# Altium project LoaPhuong_Main.PrjPcb
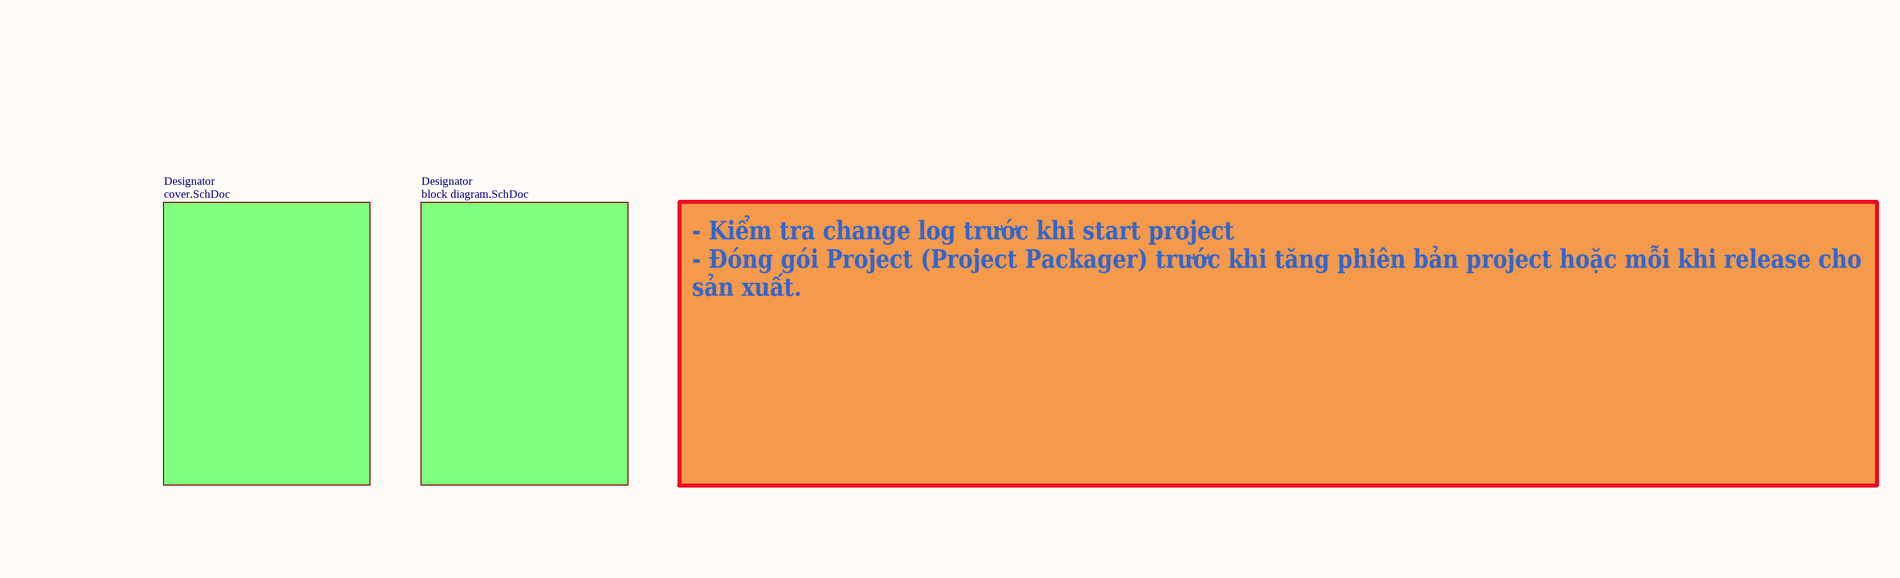
[diagram p0: root.SchDoc, left]
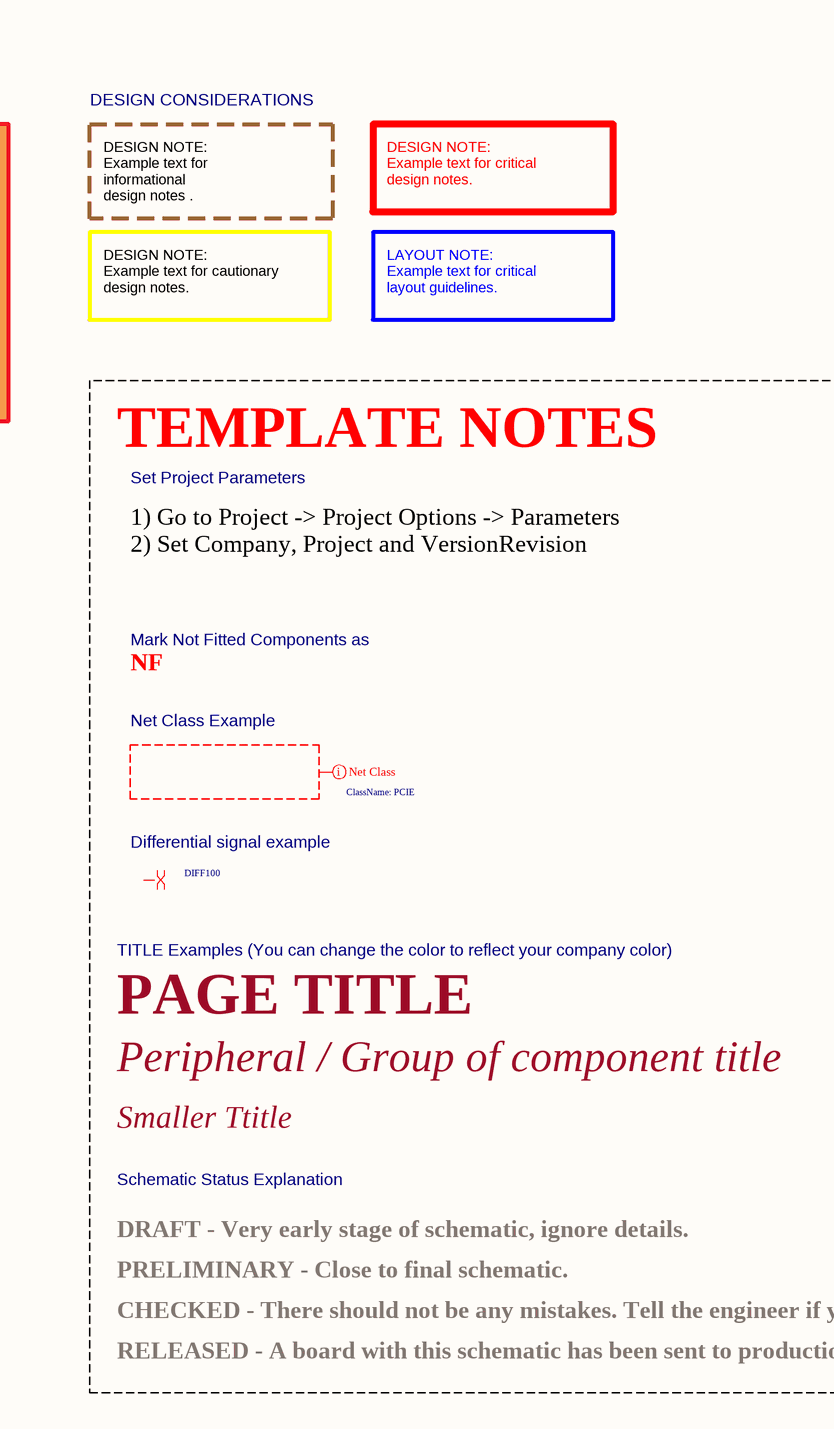
[diagram p1: root.SchDoc, right]
VersionRevision: v1.0A
7 sheets, 214 parts. Net scope: hierarchical (ports join the sheet entries above them; power ports are global).
Board file: Final_Project.PcbDoc
Sheets:
  root.SchDoc
    Designator = cover.SchDoc
    Designator = block diagram.SchDoc
      U_4G = 4G.SchDoc
      U_Wifi = Wifi.SchDoc
      U_Audio = Audio.SchDoc
      U_Power = Power.SchDoc

## Sheet root.SchDoc: PROJECT DIAGRAM
size A2; ApprovedBy: ---; CheckedBy: ---; CompanyName: BINHANH ELECTRONICS; DrawnBy: BienNB; DocumentNumber: 1; Revision: V1.0; SheetNumber: 1; SheetTotal: 11; PageSetup: Record=PageOptions|CenterHorizontal=True|CenterVertical=True|PrintScale=1.07|XCorrection=1.00|YCorrection=1.00|PrintKind=1|BorderSize=5000000|LeftOffset=0|BottomOffset=0|Orientation=2|PaperLength=1000|PaperWidth=1000|Scale=100|PaperSource=7|PrintQuality=600|MediaType=1|DitherType=10|PaperKind=A3|PrintScaleMode=1; Stage: DRAFT

### Sub-sheets
Designator = cover.SchDoc: no entries
Designator = block diagram.SchDoc: no entries

### Layout directives
net class PCIE: (no net found under the mark)
differential pair; net class DIFF100: (no net found under the mark)

### Notes on the sheet
- DESIGN CONSIDERATIONS
- DESIGN NOTE:
  Example text for informational
  design notes .
- DESIGN NOTE:
  Example text for critical
  design notes.
- DESIGN NOTE:
  Example text for cautionary
  design notes.
- LAYOUT NOTE:
  Example text for critical
  layout guidelines.
- - Kiểm tra change log trước khi start project
  - Đóng gói Project (Project Packager) trước khi tăng phiên bản project hoặc mỗi khi release cho sản xuất.
- TEMPLATE NOTES
- Set Project Parameters
- 1) Go to Project -> Project Options -> Parameters
  2) Set Company, Project and VersionRevision
- NF
- Mark Not Fitted Components as
- Net Class Example
- Differential signal example
- TITLE Examples (You can change the color to reflect your company color)
- PAGE TITLE
- Peripheral / Group of component title
- Smaller Ttitle
- Schematic Status Explanation
- PRELIMINARY - Close to final schematic.
- DRAFT - Very early stage of schematic, ignore details.
- RELEASED - A board with this schematic has been sent to production.
- CHECKED - There should not be any mistakes. Tell the engineer if you find one.
- Project:
- File:
- Size
- Rev
- A2
- Sheet
- /
- Drawn by:
- Checked by:
- Approved by:

## Sheet cover.SchDoc
size A3; DocumentNumber: 2; Revision: V1.0; SheetNumber: 2; SheetTotal: 11; Stage: DRAFT
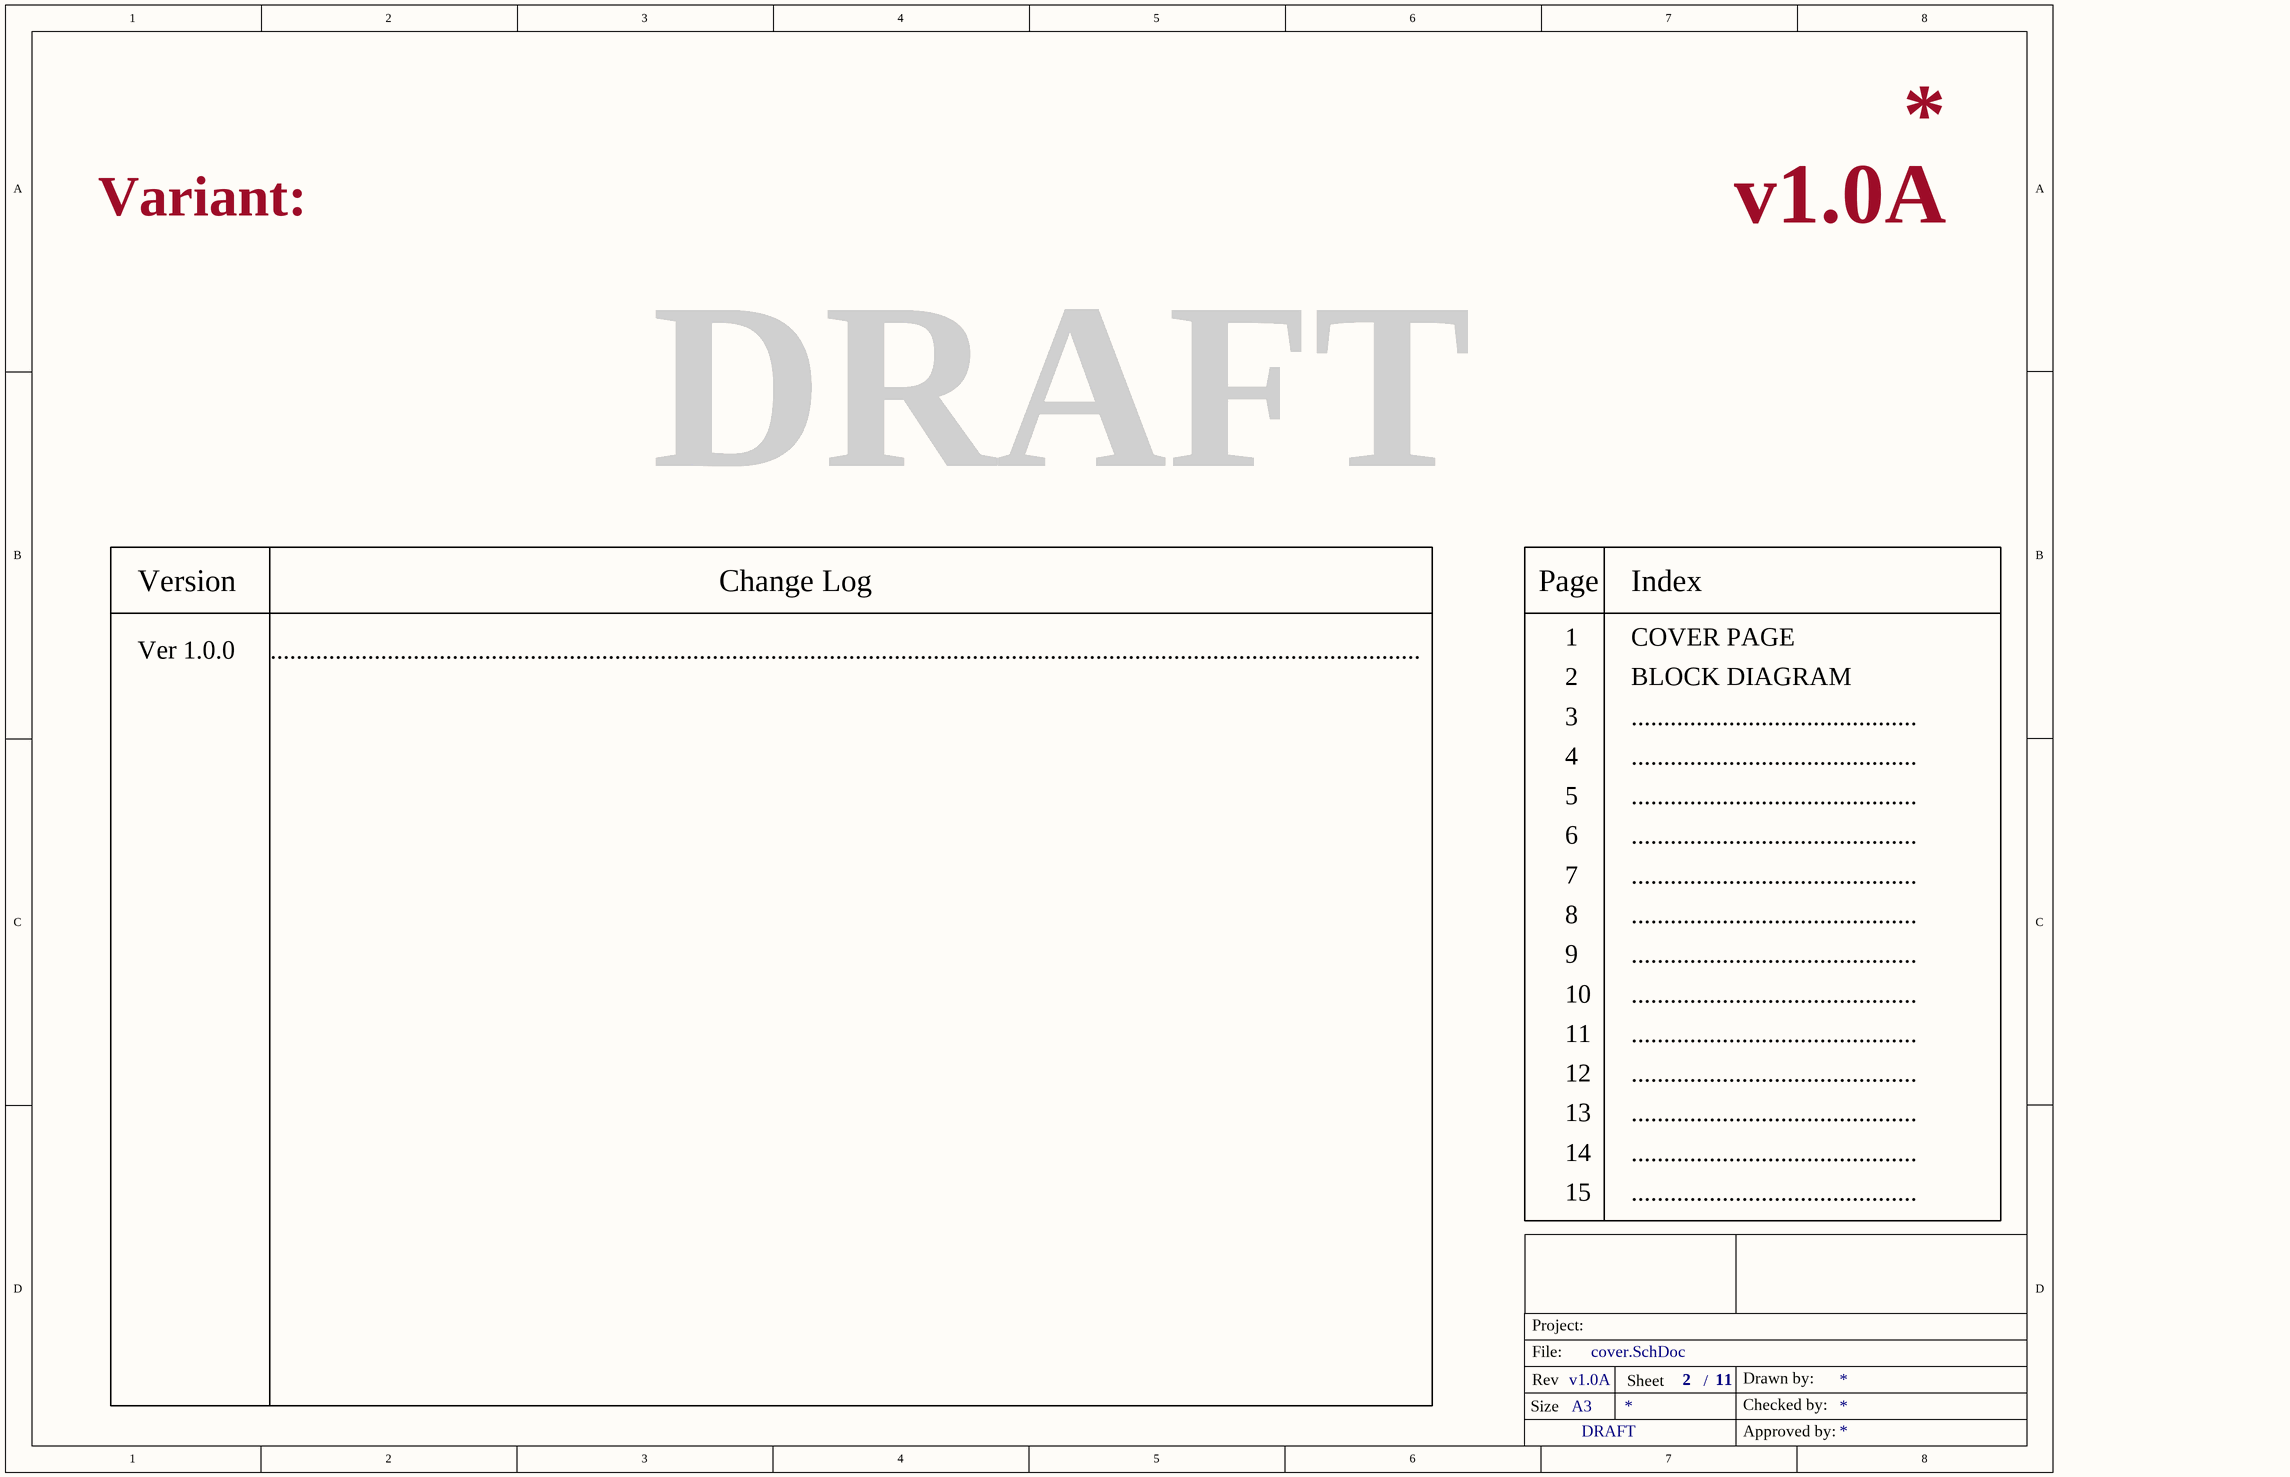
[diagram p2: cover.SchDoc]

### Notes on the sheet
- Variant:
- Version
- Change Log
- Page
- Index
- Ver 1.0.0
- .................................................................................................................................................................................
- 1
- 2
- COVER PAGE
- BLOCK DIAGRAM
- 3
- 4
- ............................................
- 5
- 6
- 7
- 8
- 9
- 10
- 11
- 12
- 13
- 14
- 15
- Project:
- File:
- Size
- Rev
- A3
- Sheet
- /
- Drawn by:
- Checked by:
- Approved by:

## Sheet block diagram.SchDoc
size A3; DocumentNumber: 3; Revision: V1.0; SheetNumber: 3; SheetTotal: 11; Stage: DRAFT
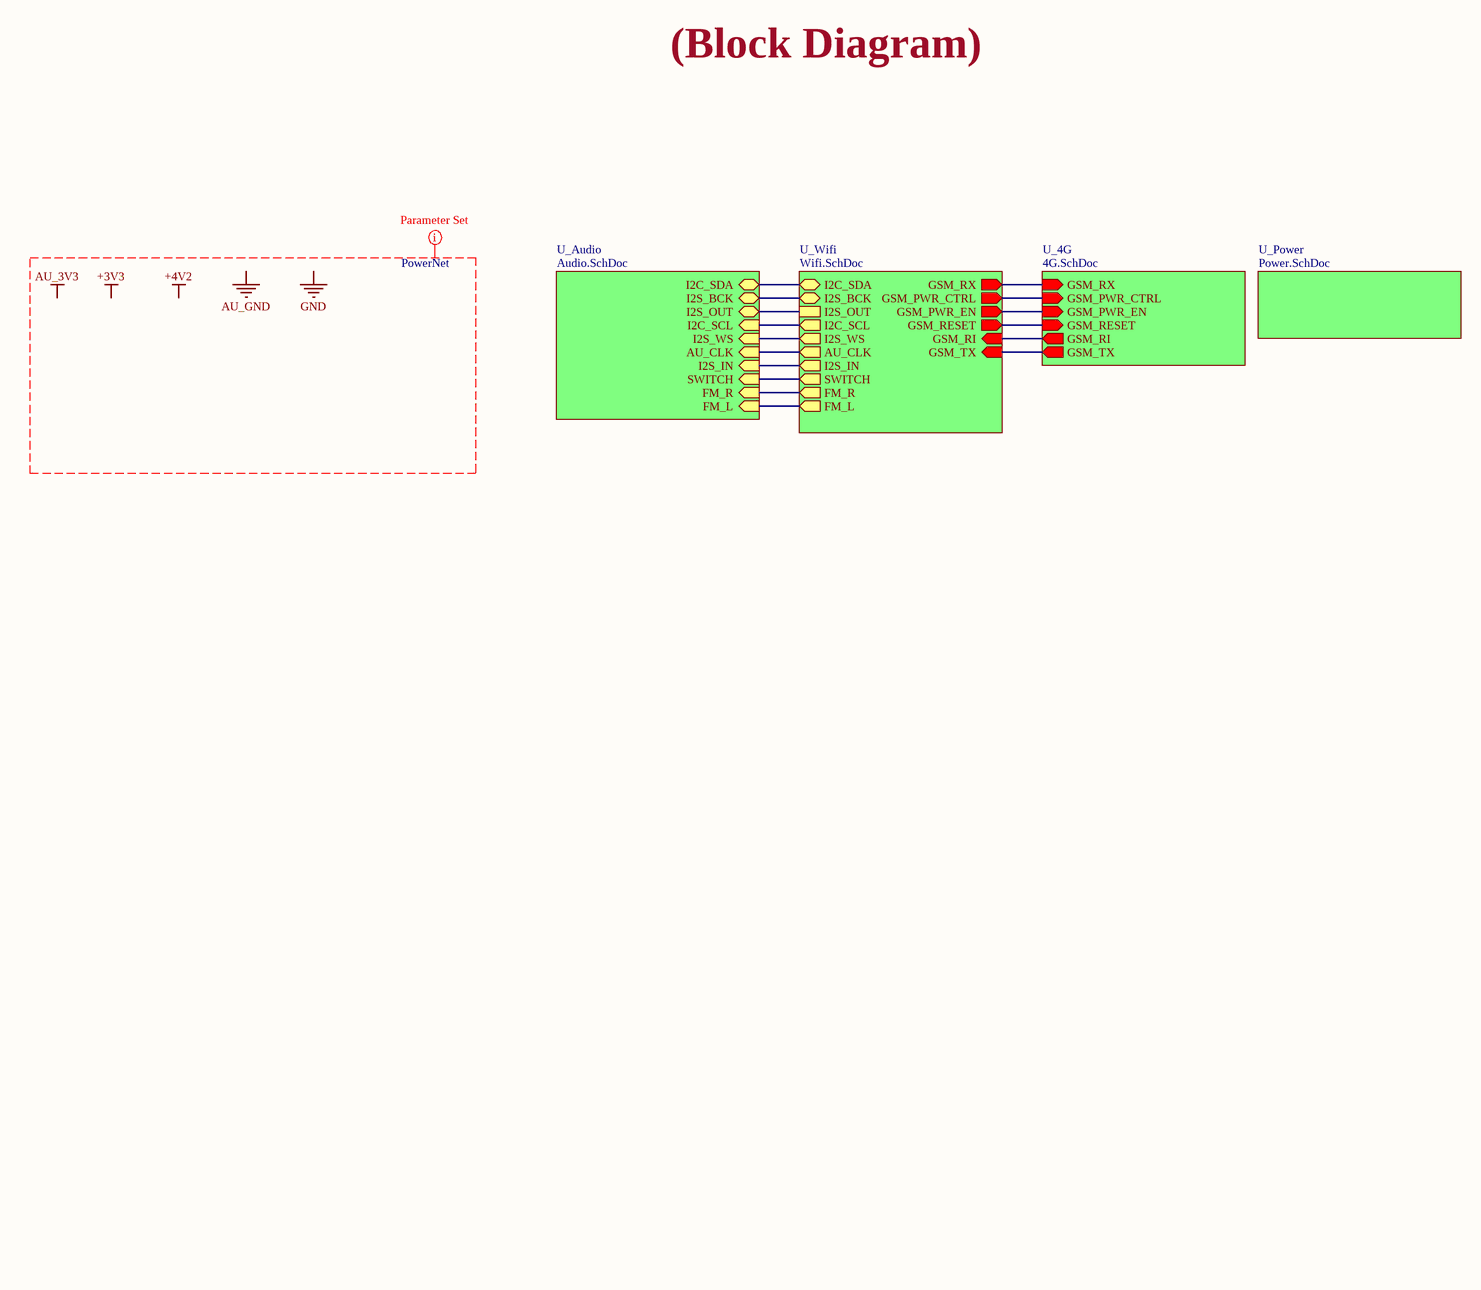
[diagram p3: block diagram.SchDoc]

### Sub-sheets
U_4G = 4G.SchDoc: GSM_PWR_EN (in), GSM_RESET (in), GSM_PWR_CTRL (in), GSM_RX (in), GSM_TX (out), GSM_RI (out)
U_Audio = Audio.SchDoc: I2C_SCL (in), I2C_SDA (bidir), I2S_BCK (bidir), I2S_WS (in), I2S_IN (in), I2S_OUT (bidir), AU_CLK (in), SWITCH (in), FM_L (in), FM_R (in)
U_Power = Power.SchDoc: no entries
U_Wifi = Wifi.SchDoc: I2C_SCL (out), I2C_SDA (bidir), I2S_BCK (bidir), I2S_OUT, I2S_WS (out), I2S_IN (out), GSM_RX (out), GSM_TX (in), GSM_RI (in), AU_CLK (out), FM_L (out), FM_R (out), GSM_PWR_CTRL (out), GSM_PWR_EN (out), GSM_RESET (out), SWITCH (out)

### Nets
ESP_RX: sheet U_Wifi/AU_CLK, sheet U_Audio/AU_CLK
FM_L: sheet U_Wifi/FM_L, sheet U_Audio/FM_L
FM_R: sheet U_Wifi/FM_R, sheet U_Audio/FM_R
GSM_PWKEY: sheet U_4G/GSM_PWR_EN, sheet U_Wifi/GSM_PWR_EN
GSM_PWR_EN: sheet U_4G/GSM_PWR_CTRL, sheet U_Wifi/GSM_PWR_CTRL
GSM_RESET: sheet U_4G/GSM_RESET, sheet U_Wifi/GSM_RESET
SCL: sheet U_Wifi/I2C_SCL, sheet U_Audio/I2C_SCL
SDA: sheet U_Wifi/I2C_SDA, sheet U_Audio/I2C_SDA
SWITCH_FM: sheet U_Wifi/SWITCH, sheet U_Audio/SWITCH
NetM1_62: sheet U_4G/GSM_RI, sheet U_Wifi/GSM_RI
NetM1_67: sheet U_4G/GSM_TX, sheet U_Wifi/GSM_TX
NetM1_68: sheet U_4G/GSM_RX, sheet U_Wifi/GSM_RX
NetR23_1: sheet U_Wifi/I2S_BCK, sheet U_Audio/I2S_BCK
NetR24_1: sheet U_Wifi/I2S_WS, sheet U_Audio/I2S_WS
NetR25_1: sheet U_Wifi/I2S_IN, sheet U_Audio/I2S_IN
NetR26_1: sheet U_Wifi/I2S_OUT, sheet U_Audio/I2S_OUT

### Layout directives
net class PowerNet: +3V3, +4V2, AU_3V3, AU_GND, GND

### Notes on the sheet
- (Block Diagram)
- CLOCKS (CPU & PCIE)
- Labels drawn without touching a wire or pin: +3V3, +4V2, AU_3V3, AU_GND, GND
- Project:
- File:
- Size
- Rev
- A3
- Sheet
- /
- Drawn by:
- Checked by:
- Approved by:

## Sheet 4G.SchDoc: 4G
size A3; Organization: Altium Limited; Address1: L3, 12a Rodborough Rd; Address2: Frenchs Forest; Address3: NSW; Address4: Australia 2086; Stage: DRAFT
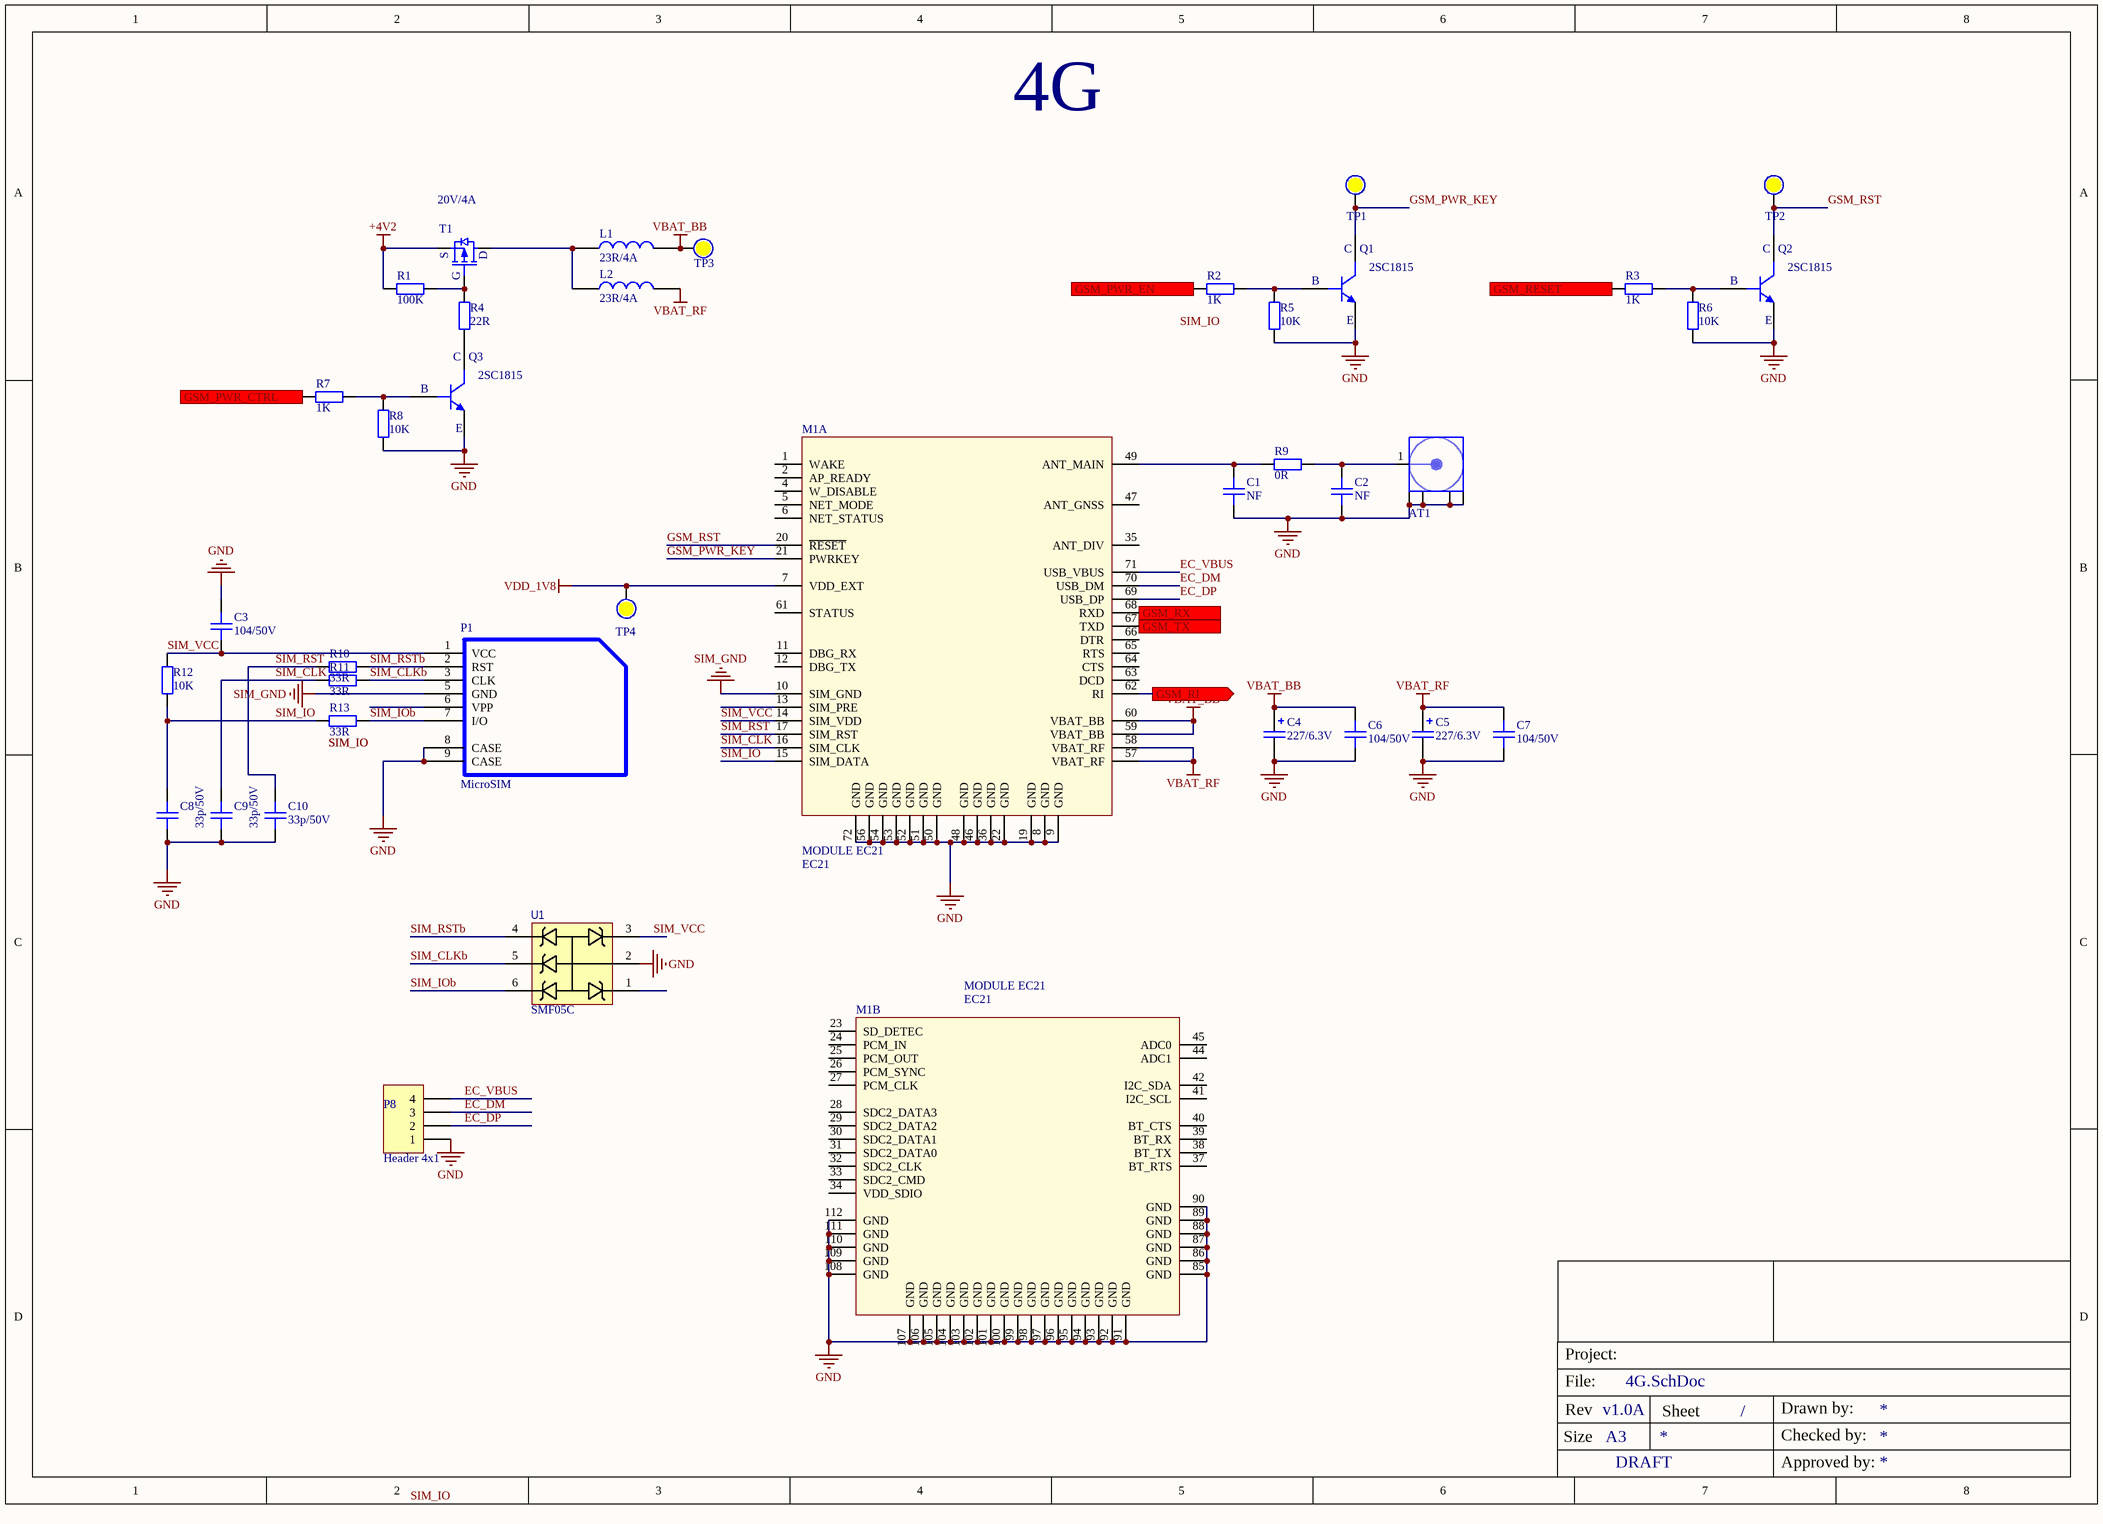
[diagram p4: 4G.SchDoc]

### Parts
AT1  AT-GSM-GPS  [SNW_H11-L17-SMA]  (value not drawn)
C1  NF  [CAPC-0603 (1608)]
C2  NF  [CAPC-0603 (1608)]
C3  104/50V  [CAPC-0603 (1608)]
C4  227/6.3V  [CAP_TANTAL_1210(3528)]
C5  227/6.3V  [CAP_TANTAL_1210(3528)]
C6  104/50V  [CAPC-0603 (1608)]
C7  104/50V  [CAPC-0603 (1608)]
C8  33p/50V  [CAPC-0603 (1608)]
C9  33p/50V  [CAPC-0603 (1608)]
C10  33p/50V  [CAPC-0603 (1608)]
L1  23R/4A  [IND-0603 (1608)]
L2  23R/4A  [IND-0603 (1608)]
M1  MODULE EC21  Part Number: EC21  [QUECTEL_EC20]  (parts A,B of 3)
P1  MicroSIM  [MUP-C792]
P8  Header 4x1  [HDR1X4]
Q1  2SC1815  [SOT23_3]
Q2  2SC1815  [SOT23_3]
Q3  2SC1815  [SOT23_3]
R1  100K  [RESC-0603 (1608)]
R2  1K  [RESC-0603 (1608)]
R3  1K  [RESC-0603 (1608)]
R4  22R  [RESC-0603 (1608)]
R5  10K  [RESC-0603 (1608)]
R6  10K  [RESC-0603 (1608)]
R7  1K  [RESC-0603 (1608)]
R8  10K  [RESC-0603 (1608)]
R9  0R  [RESC-0603 (1608)]
R10  33R  [RESC-0603 (1608)]
R11  33R  [RESC-0603 (1608)]
R12  10K  [RESC-0603 (1608)]
R13  33R  [RESC-0603 (1608)]
T1  20V/4A  [SOT23_3]
TP1  (no value)  [Test Point 1.5 MM]  (no BOM)
TP2  (no value)  [Test Point 1.5 MM]  (no BOM)
TP3  (no value)  [Test Point 1.5 MM]  (no BOM)
TP4  (no value)  [Test Point 1.5 MM]  (no BOM)
U1  SMF05C  [SOT65P210X140-6N]

### Ports
GSM_PWR_CTRL (in), GSM_PWR_EN (in), GSM_RESET (in), GSM_RI (out), GSM_RX (in), GSM_TX (out)

### Nets
+4V2: R1.1 T1.2(S)
GND: AT1.2 C1.1 C2.1 C3.2 C4.2 C5.2 C6.1 C7.1 C8.1 C9.1 C10.1 M1.8(GND) M1.9(GND) M1.19(GND) M1.22(GND) M1.36(GND) M1.46(GND) M1.48(GND) M1.50(GND) M1.51(GND) M1.52(GND) M1.53(GND) M1.54(GND) M1.56(GND) M1.72(GND) M1.85(GND) M1.86(GND) M1.87(GND) M1.88(GND) M1.89(GND) M1.90(GND) M1.91(GND) M1.92(GND) M1.93(GND) M1.94(GND) M1.95(GND) M1.96(GND) M1.97(GND) M1.98(GND) M1.99(GND) M1.100(GND) M1.101(GND) M1.102(GND) M1.103(GND) M1.104(GND) M1.105(GND) M1.106(GND) M1.107(GND) M1.108(GND) M1.109(GND) M1.110(GND) M1.111(GND) M1.112(GND) P1.8(CASE) P1.9(CASE) P8.1 Q1.2(E) Q2.2(E) Q3.2(E) R5.1 R6.1 R8.1 U1.2(AN)
SIM_GND: M1.10(SIM_GND) P1.5(GND)
VBAT_BB: C4.1 C6.2 L1.2 M1.59(VBAT_BB) M1.60(VBAT_BB) TP3.0
VBAT_RF: C5.1 C7.2 L2.2 M1.57(VBAT_RF) M1.58(VBAT_RF)
VDD_1V8: M1.7(VDD_EXT) TP4.0
EC_DM: M1.70(USB_DM) P8.3
EC_DP: M1.69(USB_DP) P8.2
EC_VBUS: M1.71(USB_VBUS) P8.4
GSM_PWKEY: R2.1 ; port GSM_PWR_EN
GSM_PWR_EN: R7.1 ; port GSM_PWR_CTRL
GSM_PWR_KEY: M1.21(PWRKEY) Q1.3(C) TP1.0
GSM_RESET: R3.1 ; port GSM_RESET
GSM_RST: M1.20(~{RESET}) Q2.3(C) TP2.0
SIM_CLK: C9.2 M1.16(SIM_CLK) R11.2
SIM_CLKb: P1.3(CLK) R11.1 U1.5(CT4)
SIM_IO: C8.2 M1.15(SIM_DATA) R12.1 R13.2
SIM_IOb: P1.7(I/O) R13.1 U1.6(CT5)
SIM_RST: C10.2 M1.17(SIM_RST) R10.2
SIM_RSTb: P1.2(RST) R10.1 U1.4(CT3)
SIM_VCC: C3.1 M1.14(SIM_VDD) P1.1(VCC) R12.2 U1.3(CT2)
NetAT1_1: AT1.1(Signal) C2.2 R9.2
NetC1_2: C1.2 M1.49(ANT_MAIN) R9.1
NetL1_1: L1.1 L2.1 T1.3(D)
NetM1_62: M1.62(RI) ; port GSM_RI
NetM1_67: M1.67(TXD) ; port GSM_TX
NetM1_68: M1.68(RXD) ; port GSM_RX
NetQ1_1: Q1.1(B) R2.2 R5.2
NetQ2_1: Q2.1(B) R3.2 R6.2
NetQ3_1: Q3.1(B) R7.2 R8.2
NetQ3_3: Q3.3(C) R4.1
NetR1_2: R1.2 R4.2 T1.1(G)

Not connected (* = marked no-connect by the designer): M1 1(WAKE) 2(AP_READY) 4(W_DISABLE) 5(NET_MODE) 6(NET_STATUS) 11(DBG_RX) 12(DBG_TX) 13(SIM_PRE) 23(SD_DETEC) 24(PCM_IN) 25(PCM_OUT) 26(PCM_SYNC) 27(PCM_CLK) 28(SDC2_DATA3) 29(SDC2_DATA2) 30(SDC2_DATA1) 31(SDC2_DATA0) 32(SDC2_CLK) 33(SDC2_CMD) 34(VDD_SDIO) 35(ANT_DIV) 37(BT_RTS) 38(BT_TX) 39(BT_RX) 40(BT_CTS) 41(I2C_SCL) 42(I2C_SDA) 44(ADC1) 45(ADC0) 47(ANT_GNSS) 61(STATUS) 63(DCD) 64(CTS) 65(RTS) 66(DTR); P1 6(VPP); U1 1(CT1)

### Notes on the sheet
- Labels drawn without touching a wire or pin: SIM_IO
- Project:
- File:
- Size
- Rev
- A3
- Sheet
- /
- Drawn by:
- Checked by:
- Approved by:

### Library data of the parts
AT1 = SNW_H11-L17-SMA: CONNECTER ANTENNA GPS GSM; MFR: Sunny Way; Solder: HAND; MPN: SNW_H11-L17-SMA; Value: AT-GSM-GPS; ClassName: MECHANICAL
C1 C2 = CAPC NF 0603: CAP SMD, Not Fill, 0603; Solder: Not Fill; Value: NF; Category: CAPACITOR
C3 C6 C7 = C0603C104K5RACTU: CAP CER 0.1uF 50V 10% X7R 0603; CompanyID: VT-00982; Solder: SMT; MPN: C0603C104K5RACTU; Value: 104/50V; Category: CAPACITOR
C4 C5 = T520B227M006ATE035: CAP TANT POLY 220uF 20% 6.3V 3528 35mOhm ESR; Solder: SMT; CompanyID: VT-00643; Value: 227/6.3V; MPN: T520B227M006ATE035; Category: CAPACITOR
C8-C10 = 0603N330J500CT: CAP CER 33pF 50V 5%  0603; MPN: CL10C330JB8NNNC; CompanyID: VT-01106; Solder: SMT; Value: 33p/50V; Category: CAPACITOR
L1 L2 = FBMJ1608HM230NT: IND-FERRITE BEAD 23 OHM  4A 0603 1LN; CompanyID: VT-01060; Solder: SMT; MPN: FBMJ1608HM230NT; Value: 23R/4A; Category: FERRITE BEAD
M1 = QUECTEL EC21: Quectel EC21 is a series of LTE category; Brand: Quectel
P1 = MUP-C792: MicroSIM Card Push - Push Holder; MFR: MUP; MPN: C792; Solder: SMT; ClassName: MECHANICAL
P8 = Header 4x1: Header, 4 Pin Pitch 2.54mm; MPN: S1012EC-40-ND; Solder: WAVE; Value: Header 4P; ClassName: MECHANICAL
Q1-Q3 = 2SC1815: TRANS NPN 50V 0.15A SOT23-3; Solder: SMT; MPN: 2SC1815; Value: 2SC1815
R1 = RC0603FR-07100KL: RES SMD 100K OHM 1% 1/10W 0603; CompanyID: VT-00332; Solder: SMT; MPN: RC0603FR-07100KL; Value: 100K; Category: RESISTOR
R2 R3 R7 = RC0603FR-071KL: RES SMD 1 KOHM 1% 1/10W 0603; CompanyID: VT-00574; Solder: SMT; MPN: RC0603FR-071KL; Value: 1K; Category: RESISTOR
R4 = RC0603FR-0722RL: RES SMD 22 OHM 1% 1/10W 0603; CompanyID: VT-00881; Solder: SMT; Value: 22R; MPN: RC0603FR-0722RL; Category: RESISTOR
R5 R6 R8 R12 = RC0603FR-0710KL: RES SMD 10K OHM 1% 1/10W 0603; CompanyID: VT-00328; Solder: SMT; MPN: RC0603FR-0710KL; Value: 10K; Category: RESISTOR
R9 = RC0603FR-070RL: RES SMD 0.0OHM JUMPER 1/10W 0603; CompanyID: VT-00901; Solder: SMT; MPN: RC0603FR-070RL; Value: 0R; Category: RESISTOR
R10 R11 R13 = RC0603FR-0733RL: RES SMD 33 OHM 1% 1/10W 0603; MFR: Yageo; Solder: SMT; MPN: RC0603FR-0733RL; Value: 33R; Category: RESISTOR
T1 = AO3415: MOSFET P-CH 20V 4A SOT23; MFR: Alpha & Omega Semiconductor Inc.; Solder: SMT; Value: 20V/4A; MPN: AO3415
TP1-TP4 = Test Point: Solder: NF
U1 = SMF05C: TVS Diode Array For ESD and Latch-Up Protection; MFR: ON SEMICONDUCTOR; Value: SMF05CT2G; Solder: SMT; CompanyID: VT-0; ComponentLink1URL: http://www.onsemi.com/pub/Collateral/SMF05C-D.PDF; ComponentLink1Description: http://www.onsemi.com/pub/Collateral/SMF05C-D.PDF; MPN: SMF05CT2G; Category: IC

## Sheet Wifi.SchDoc: Wifi_Main
size A3; Author: TueTD; DrawnBy: TueTD; DocumentNumber: 1; Revision: V1.0; SheetNumber: 1; Stage: DRAFT; ENG_APP_DATE: --/--/--; DSN_APP_DATE: --/--/--; CHK_APP_DATE: --/--/--
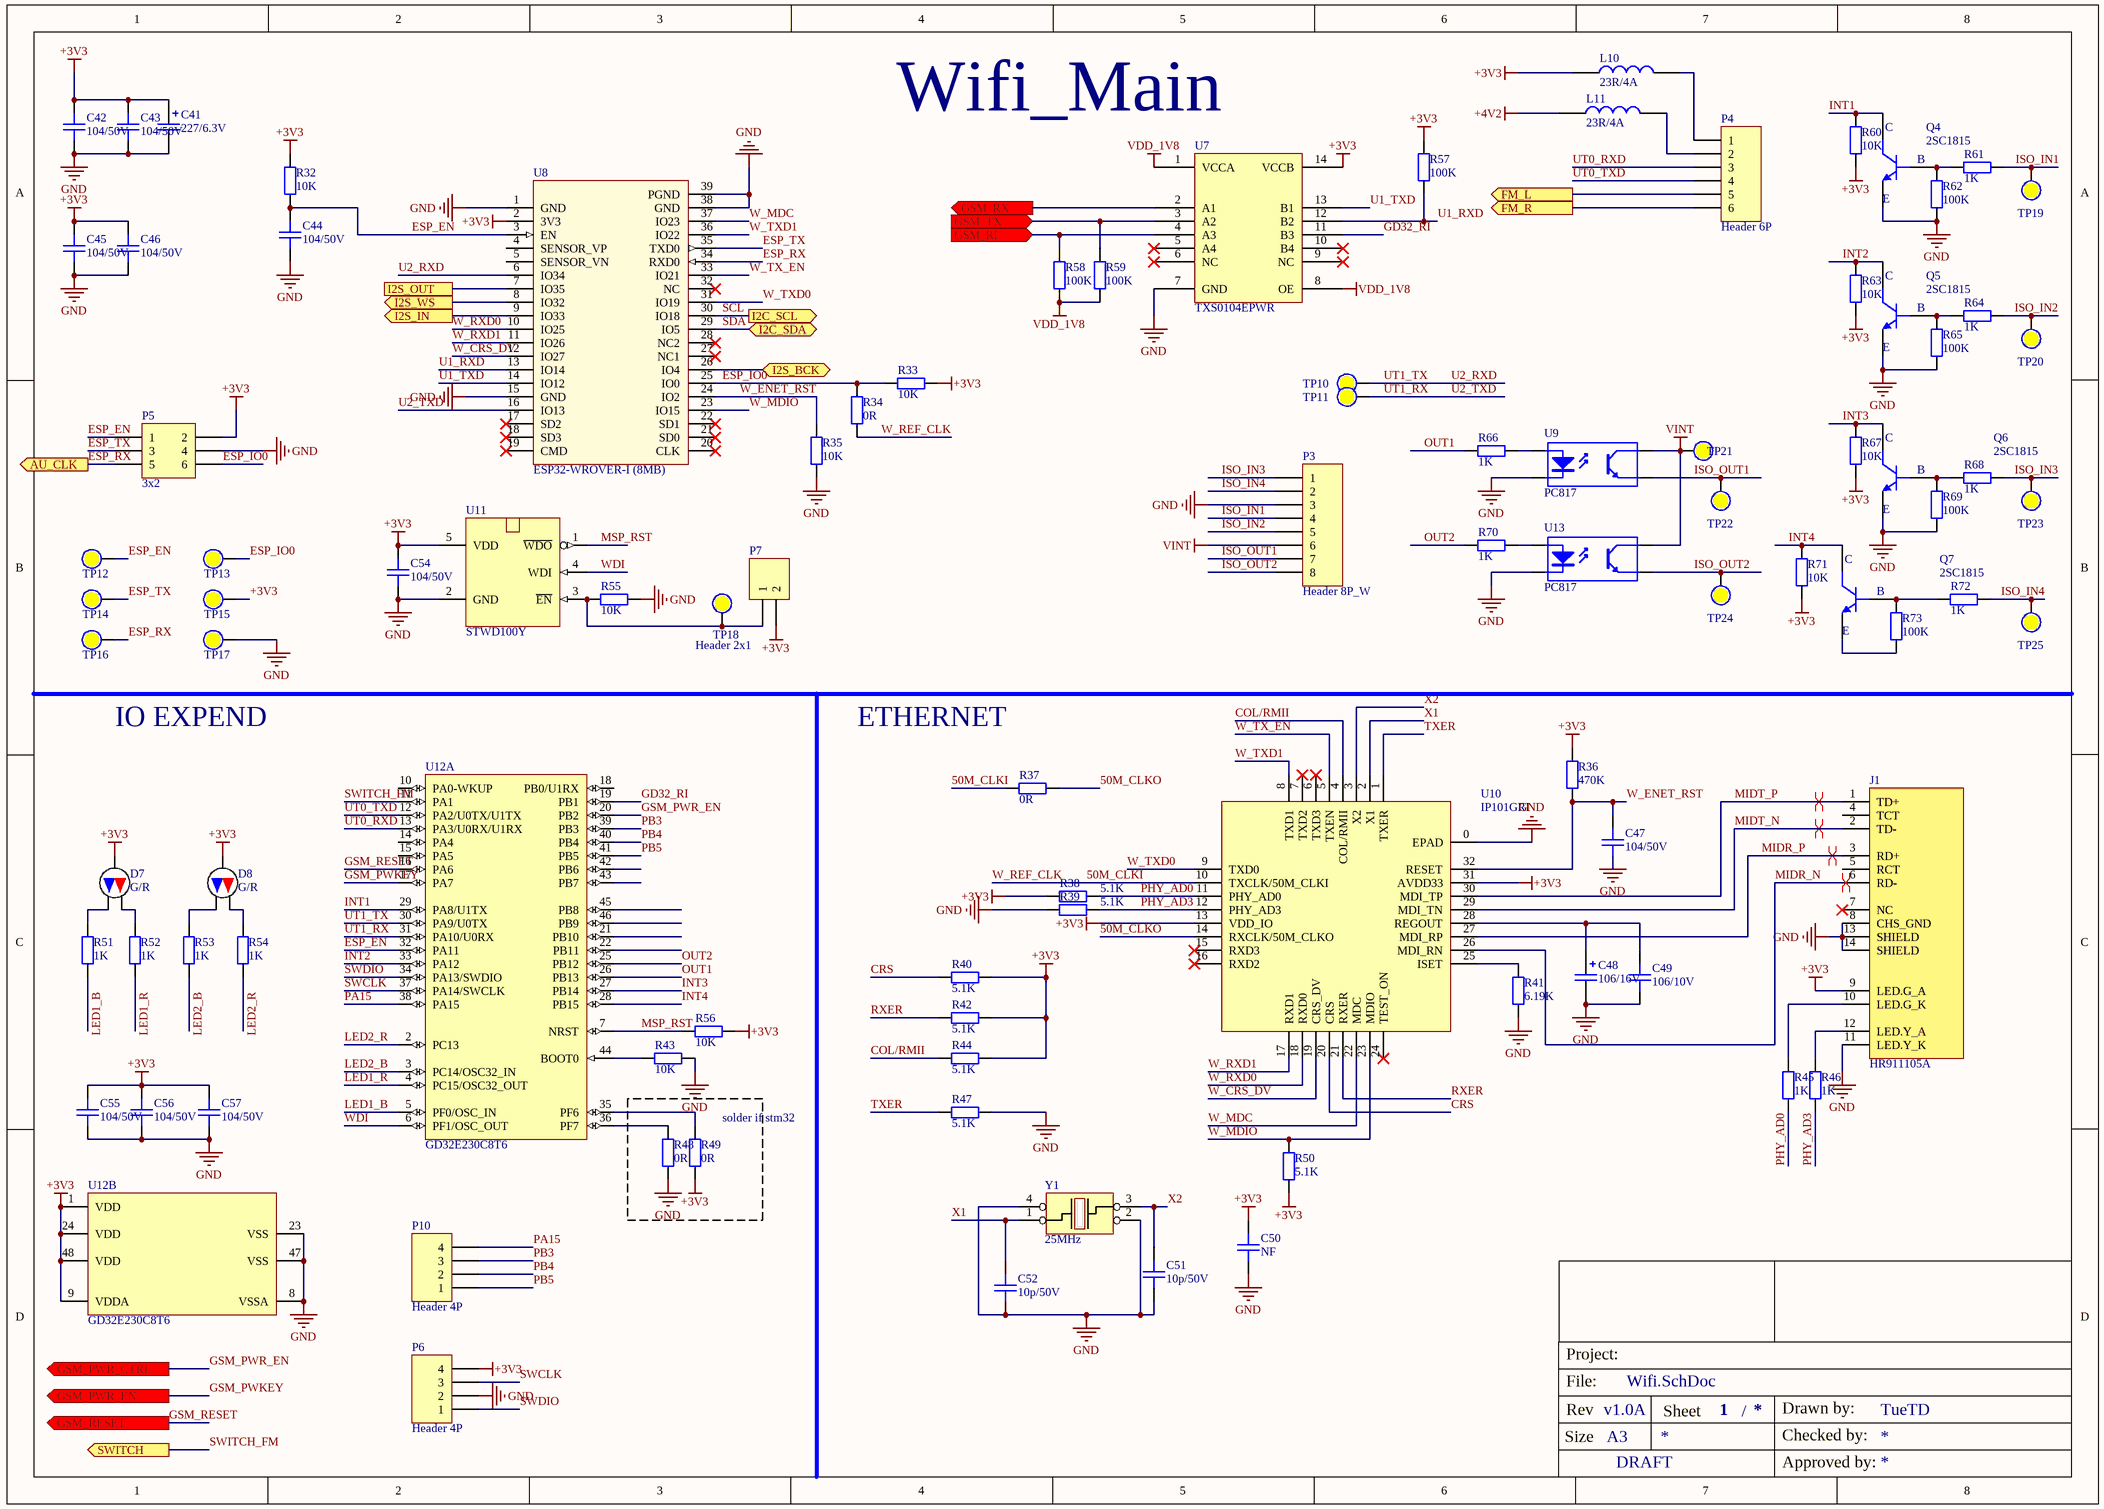
[diagram p5: Wifi.SchDoc]

### Parts
C41  227/6.3V  [CAP_TANTAL_1210(3528)]
C42  104/50V  [CAPC-0603 (1608)]
C43  104/50V  [CAPC-0603 (1608)]
C44  104/50V  [CAPC-0603 (1608)]
C45  104/50V  [CAPC-0603 (1608)]
C46  104/50V  [CAPC-0603 (1608)]
C47  104/50V  [CAPC-0603 (1608)]
C48  106/16V  [CAP_TANTAL_1210(3528)]
C49  106/10V  [CAPC-0603 (1608)]
C50  NF  [CAPC-0603 (1608)]
C51  10p/50V  [CAPC-0603 (1608)]
C52  10p/50V  [CAPC-0603 (1608)]
C54  104/50V  [CAPC-0603 (1608)]
C55  104/50V  [CAPC-0603 (1608)]
C56  104/50V  [CAPC-0603 (1608)]
C57  104/50V  [CAPC-0603 (1608)]
D7  G/R  [LED3301-15]
D8  G/R  [LED3301-15]
J1  HR911105A  [HR911105A]
L10  23R/4A  [IND-0603 (1608)]
L11  23R/4A  [IND-0603 (1608)]
P3  Header 8P_W  [HDR1X8 - W]
P4  Header 6P  [HDR1X6 - W]
P5  3x2  [IDE6 1.27mm]
P6  Header 4P  [HDR1X4]
P7  Header 2x1  [HDR1X2]
P10  Header 4P  [HDR1X4]
Q4  2SC1815  [SOT23_3]
Q5  2SC1815  [SOT23_3]
Q6  2SC1815  [SOT23_3]
Q7  2SC1815  [SOT23_3]
R32  10K  [RESC-0603 (1608)]
R33  10K  [RESC-0603 (1608)]
R34  0R  [RESC-0603 (1608)]
R35  10K  [RESC-0603 (1608)]
R36  470K  [RESC-0603 (1608)]
R37  0R  [RESC-0603 (1608)]
R38  5.1K  [RESC-0603 (1608)]
R39  5.1K  [RESC-0603 (1608)]
R40  5.1K  [RESC-0603 (1608)]
R41  6.19K  [RESC-0603 (1608)]
R42  5.1K  [RESC-0603 (1608)]
R43  10K  [RESC-0603 (1608)]
R44  5.1K  [RESC-0603 (1608)]
R45  1K  [RESC-0603 (1608)]
R46  1K  [RESC-0603 (1608)]
R47  5.1K  [RESC-0603 (1608)]
R48  0R  [RESC-0603 (1608)]
R49  0R  [RESC-0603 (1608)]
R50  5.1K  [RESC-0603 (1608)]
R51  1K  [RESC-0603 (1608)]
R52  1K  [RESC-0603 (1608)]
R53  1K  [RESC-0603 (1608)]
R54  1K  [RESC-0603 (1608)]
R55  10K  [RESC-0603 (1608)]
R56  10K  [RESC-0603 (1608)]
R57  100K  [RESC-0603 (1608)]
R58  100K  [RESC-0603 (1608)]
R59  100K  [RESC-0603 (1608)]
R60  10K  [RESC-0603 (1608)]
R61  1K  [RESC-0603 (1608)]
R62  100K  [RESC-0603 (1608)]
R63  10K  [RESC-0603 (1608)]
R64  1K  [RESC-0603 (1608)]
R65  100K  [RESC-0603 (1608)]
R66  1K  [RESC-0603 (1608)]
R67  10K  [RESC-0603 (1608)]
R68  1K  [RESC-0603 (1608)]
R69  100K  [RESC-0603 (1608)]
R70  1K  [RESC-0603 (1608)]
R71  10K  [RESC-0603 (1608)]
R72  1K  [RESC-0603 (1608)]
R73  100K  [RESC-0603 (1608)]
TP10  (no value)  [Test Point 1.5 MM]  (no BOM)
TP11  (no value)  [Test Point 1.5 MM]  (no BOM)
TP12  (no value)  [Test Point 1.5 MM]  (no BOM)
TP13  (no value)  [Test Point 1.5 MM]  (no BOM)
TP14  (no value)  [Test Point 1.5 MM]  (no BOM)
TP15  (no value)  [Test Point 1.5 MM]  (no BOM)
TP16  (no value)  [Test Point 1.5 MM]  (no BOM)
TP17  (no value)  [Test Point 1.5 MM]  (no BOM)
TP18  (no value)  [Test Point 1.5 MM]  (no BOM)
TP19  (no value)  [Test Point 1.5 MM]  (no BOM)
TP20  (no value)  [Test Point 1.5 MM]  (no BOM)
TP21  (no value)  [Test Point 1.5 MM]  (no BOM)
TP22  (no value)  [Test Point 1.5 MM]  (no BOM)
TP23  (no value)  [Test Point 1.5 MM]  (no BOM)
TP24  (no value)  [Test Point 1.5 MM]  (no BOM)
TP25  (no value)  [Test Point 1.5 MM]  (no BOM)
U7  TXS0104EPWR  [TSOP65P640X120-14N]
U8  ESP32-WROVER-I (8MB)  [ESP32-WROVER]
U9  PC817  [Opto 1]
U10  IP101GRI  [32-VQFN IP101]
U11  STWD100Y  [SOT23-5]
U12  GD32E230C8T6  [LQFP-48]  (parts A,B of 2)
U13  PC817  [Opto 1]
Y1  25MHz  [CRYSTALL_SMD_3225]

### Blocks framed on the sheet
solder if stm32: R48 R49

### Ports
AU_CLK (out), FM_L (out), FM_R (out), GSM_PWR_CTRL (out), GSM_PWR_EN (out), GSM_RESET (out), GSM_RI (in), GSM_RX (out), GSM_TX (in), I2C_SCL (out), I2C_SDA (bidir), I2S_BCK (bidir), I2S_IN (out), I2S_OUT, I2S_WS (out), SWITCH (out)

### Nets
+3V3: C41.1 C42.1 C43.1 C45.1 C46.1 C50.2 C54.2 C55.1 C56.1 C57.1 D7.2(A) D8.2(A) J1.9(LED.G_A) L10.1 P5.2 P6.4 P7.2 R32.2 R33.2 R36.2 R38.2 R40.1 R42.1 R44.1 R49.1 R50.1 R56.2 R57.2 R60.2 R63.2 R67.2 R71.2 TP15.0 U7.14(VCCB) U8.2(3V3) U10.13(VDD_IO) U10.31(AVDD33) U11.5(VDD) U12.1(VDD) U12.9(VDDA) U12.24(VDD) U12.48(VDD)
+4V2: L11.1
GND: C41.2 C42.2 C43.2 C44.1 C45.2 C46.2 C47.1 C48.2 C49.1 C50.1 C51.1 C52.1 C54.1 C55.2 C56.2 C57.2 J1.8(CHS_GND) J1.11(LED.Y_K) J1.13(SHIELD) J1.14(SHIELD) P3.3 P5.4 P6.2 Q4.2(E) Q5.2(E) Q6.2(E) R35.1 R39.2 R41.1 R43.2 R47.1 R48.1 R55.2 R62.1 R65.1 R69.1 TP17.0 U7.7(GND) U8.1(GND) U8.15(GND) U8.38(GND) U8.39(PGND) U9.2(K) U10.0(EPAD) U11.2(GND) U12.8(VSSA) U12.23(VSS) U12.47(VSS) U13.2(K) Y1.2 Y1.4
VDD_1V8: R58.1 R59.1 U7.1(VCCA) U7.8(OE)
VINT: P3.6 TP21.0 U9.4(C) U13.4(C)
50M_CLKI: R34.1 R37.1 U10.10(TXCLK/50M_CLKI)  [also labelled W_REF_CLK]
50M_CLKO: R37.2 U10.14(RXCLK/50M_CLKO)
COL/RMII: R44.2 U10.4(COL/RMII)
CRS: R40.2 U10.20(CRS)
ESP_EN: C44.2 P5.1 R32.1 TP12.0 U8.3(EN) U12.32(PA11)
ESP_IO0: P5.6 R33.1 R34.2 TP13.0 U8.25(IO0)
ESP_RX: P5.5 TP16.0 U8.34(RXD0) ; port AU_CLK
ESP_TX: P5.3 TP14.0 U8.35(TXD0)
FM_L: P4.5 ; port FM_L
FM_R: P4.6 ; port FM_R
GD32_RI: U7.11(B3) U12.19(PB1)
GSM_PWKEY: U12.17(PA7) ; port GSM_PWR_EN
GSM_PWR_EN: U12.20(PB2) ; port GSM_PWR_CTRL
GSM_RESET: U12.16(PA6) ; port GSM_RESET
INT1: Q4.3(C) R60.1 U12.29(PA8/U1TX)
INT2: Q5.3(C) R63.1 U12.33(PA12)
INT3: Q6.3(C) R67.1 U12.27(PB14)
INT4: Q7.3(C) R71.1 U12.28(PB15)
ISO_IN1: P3.4 R61.2 TP19.0
ISO_IN2: P3.5 R64.2 TP20.0
ISO_IN3: P3.1 R68.2 TP23.0
ISO_IN4: P3.2 R72.2 TP25.0
ISO_OUT1: P3.7 TP22.0 U9.3(E)
ISO_OUT2: P3.8 TP24.0 U13.3(E)
LED1_B: R51.1 U12.5(PF0/OSC_IN)
LED1_R: R52.1 U12.4(PC15/OSC32_OUT)
LED2_B: R53.1 U12.3(PC14/OSC32_IN)
LED2_R: R54.1 U12.2(PC13)
MIDR_N: J1.6(RD-) U10.26(MDI_RN)
MIDR_P: J1.3(RD+) U10.27(MDI_RP)
MIDT_N: J1.2(TD-) U10.29(MDI_TN)
MIDT_P: J1.1(TD+) U10.30(MDI_TP)
MSP_RST: R56.1 U11.1(~{WDO}) U12.7(NRST)
OUT1: R66.1 U12.26(PB13)
OUT2: R70.1 U12.25(PB12)
PA15: P10.4 U12.38(PA15)
PB3: P10.3 U12.39(PB3)
PB4: P10.2 U12.40(PB4)
PB5: P10.1 U12.41(PB5)
PHY_AD0: R38.1 R45.1 U10.11(PHY_AD0)
PHY_AD3: R39.1 R46.1 U10.12(PHY_AD3)
RXER: R42.2 U10.21(RXER)
SCL: U8.30(IO18) ; port I2C_SCL
SDA: U8.29(IO5) ; port I2C_SDA
SWCLK: P6.3 U12.37(PA14/SWCLK)
SWDIO: P6.1 U12.34(PA13/SWDIO)
SWITCH_FM: U12.11(PA1) ; port SWITCH
TXER: R47.2 U10.1(TXER)
U1_RXD: R57.1 U7.12(B2) U8.13(IO14)
U1_TXD: U7.13(B1) U8.14(IO12)
U2_RXD: TP10.0 U8.6(IO34) U12.30(PA9/U0TX)  [also labelled UT1_TX]
U2_TXD: TP11.0 U8.16(IO13) U12.31(PA10/U0RX)  [also labelled UT1_RX]
UT0_RXD: P4.3 U12.13(PA3/U0RX/U1RX)
UT0_TXD: P4.4 U12.12(PA2/U0TX/U1TX)
W_CRS_DV: U8.12(IO27) U10.19(CRS_DV)
W_ENET_RST: C47.2 R35.2 R36.1 U8.24(IO2) U10.32(RESET)
W_MDC: U8.37(IO23) U10.22(MDC)
W_MDIO: R50.2 U8.23(IO15) U10.23(MDIO)
W_RXD0: U8.10(IO25) U10.18(RXD0)
W_RXD1: U8.11(IO26) U10.17(RXD1)
W_TX_EN: U8.33(IO21) U10.5(TXEN)
W_TXD0: U8.31(IO19) U10.9(TXD0)
W_TXD1: U8.36(IO22) U10.8(TXD1)
WDI: U11.4(WDI) U12.6(PF1/OSC_OUT)
X1: C52.2 U10.2(X1) Y1.1
X2: C51.2 U10.3(X2) Y1.3
NetC48_1: C48.1 C49.2 U10.28(REGOUT)
NetD7_1: D7.1(KR) R51.2
NetD7_3: D7.3(KB) R52.2
NetD8_1: D8.1(KR) R53.2
NetD8_3: D8.3(KB) R54.2
NetJ1_10: J1.10(LED.G_K) R45.2
NetJ1_12: J1.12(LED.Y_A) R46.2
NetL10_2: L10.2 P4.1
NetL11_2: L11.2 P4.2
NetM1_62: R58.2 U7.4(A3) ; port GSM_RI
NetM1_67: R59.2 U7.3(A2) ; port GSM_TX
NetM1_68: U7.2(A1) ; port GSM_RX
NetP7_1: P7.1 R55.1 TP18.0 U11.3(~{EN})
NetQ4_1: Q4.1(B) R61.1 R62.2
NetQ5_1: Q5.1(B) R64.1 R65.2
NetQ6_1: Q6.1(B) R68.1 R69.2
NetQ7_1: Q7.1(B) R72.1 R73.2
NetQ7_2: Q7.2(E) R73.1
NetR23_1: U8.26(IO4) ; port I2S_BCK
NetR24_1: U8.8(IO32) ; port I2S_WS
NetR25_1: U8.9(IO33) ; port I2S_IN
NetR26_1: U8.7(IO35) ; port I2S_OUT
NetR41_2: R41.2 U10.25(ISET)
NetR43_1: R43.1 U12.44(BOOT0)
NetR48_2: R48.2 U12.36(PF7)
NetR49_2: R49.2 U12.35(PF6)
NetR66_2: R66.2 U9.1(A)
NetR70_2: R70.2 U13.1(A)

Not connected (* = marked no-connect by the designer): J1 4(TCT) 5(RCT) 7(NC)*; U7 5(A4)* 6(NC)* 9(NC)* 10(B4)*; U8 4(SENSOR_VP) 5(SENSOR_VN) 17(SD2)* 18(SD3)* 19(CMD)* 20(CLK)* 21(SD0)* 22(SD1)* 27(NC1)* 28(NC2)* 32(NC)*; U10 6(TXD3)* 7(TXD2)* 15(RXD3)* 16(RXD2)* 24(TEST_ON)*; U12 10(PA0-WKUP) 14(PA4) 15(PA5) 18(PB0/U1RX) 21(PB10) 22(PB11) 42(PB6) 43(PB7) 45(PB8) 46(PB9)

### Layout directives
differential pair; differential pair class DIFF100; net class PHY; rule Differential Pairs Routing [Pref Gap = 10mil    Min Gap  = 10mil    Max Gap  = 10milPref Width = 15mil    Min Width  = 15mil    Max Width  = 15mil]: MIDR_N, MIDR_P, MIDT_N, MIDT_P

### Notes on the sheet
- IO EXPEND
- ETHERNET
- Project:
- File:
- Size
- Rev
- A3
- Sheet
- /
- Drawn by:
- Checked by:
- Approved by:

### Library data of the parts
C41 = T520B227M006ATE035: as C4 on sheet 4G; Value: 227/6.3V; MPN: T520B227M006ATE035; Category: CAPACITOR
C42 C43 C45-C47 C54-C57 = C0603C104K5RACTU: as C3 on sheet 4G; MPN: C0603C104K5RACTU; Value: 104/50V; Category: CAPACITOR
  C54: PinCount: 2
C44 = C0603C104K5RACTU: CAP CER 0.1uF 50V 10% X7R 0603; Solder: SMT; MPN: C0603C104K5RACTU; CMT: 104/50V; Category: CAPACITOR; PinCount: 2
C48 = TAJB106K016RNJ: CAP TANT 10uF 16V 10% 1411 (3258); CompanyID: VT-01089; Solder: SMT; Value: 106/16V; MPN: TAJB106K016RNJ; Category: CAPACITOR
C49 = CL10A106KP8NNNC: CAP CER 10uF 10% 10V X5R 0603; CompanyID: VT-00984; Solder: SMT; MPN: CL10A106KP8NNNC; Value: 106/10V; Category: CAPACITOR
C50 = CAPC NF 0603: CAP SMD, Not Fill, 0603; Solder: Not Fill; Value: NF; Category: CAPACITOR
C51 C52 = CL10C100JB8NNND: CAP CER 10pF 5% 50V NP0 0603; CompanyID: VT-00983; Solder: SMT; Value: 10p/50V; MPN: CL10C100JB8NNND; Category: CAPACITOR; PinCount: 2
D7 D8 = LED_3MM_RA: LED BLUE/RED DIFFUSED T-1 T/H 3MM; MFR: SunLED; MPN: XLMDKCBD34M; Solder: WAVE; Value: B/R LED; Category: Optoelectronics; PinCount: 3; URL: https://item.taobao.com/item.htm?spm=a230r.1.14.6.66213402V6WLYs&id=605186082192&ns=1&abbucket=1#detail
J1 = HR911105A: Hanrun HR911105A RJ-45 Connector; Solder: WAVE; MPN: HR911105A; MFR: HanRun; Value: HR911105A; ClassName: MECHANICAL
L10 L11 = FBMJ1608HM230NT: as L1 on sheet 4G; MPN: FBMJ1608HM230NT; Value: 23R/4A; Category: FERRITE BEAD
P3 = Header 8x1: Header, 8 Pin Pitch 2.54mm; Solder: WAVE; Value: Header 8P_W; ClassName: MECHANICAL
P4 = Header 6x1: Header, 6 Pin Pitch 2.54mm; MPN: S1012EC-40-ND; CompanyID: VT-00125; Solder: WAVE; Value: Header 6P; ClassName: MECHANICAL
P5 = IDE6 1.27mm: Header, 6-Pin, Dual row; Solder: WAVE; ClassName: MECHANICAL
P6 P10 = Header 4x1: Header, 4 Pin Pitch 2.54mm; MPN: S1012EC-40-ND; Solder: WAVE; CMT: Header 4P
P7 = Header 2x1: Header, 2-Pin, pitch 2.54mm; Solder: WAVE; ClassName: MECHANICAL
Q4-Q7 = 2SC1815: TRANS NPN 50V 0.15A SOT23-3; Solder: SMT; MPN: 2SC1815; Value: 2SC1815
R32 = RC0603FR-0710KL: RES SMD 10K OHM 1% 1/10W 0603; CompanyID: VT00464; Solder: SMT; MPN: RC0603FR-0710KL; CMT: 10K; Category: RESISTOR
R33 R35 R43 R55 R56 R60 R63 R67 R71 = RC0603FR-0710KL: as R5 on sheet 4G; MPN: RC0603FR-0710KL; Value: 10K; Category: RESISTOR
R34 R37 R48 R49 = RC0603FR-070RL: as R9 on sheet 4G; MPN: RC0603FR-070RL; Value: 0R; Category: RESISTOR
R36 = RC0603FR-07470KL: RES SMD 470K OHM 1% 1/10W 0603; Solder: SMT; Value: 470K; MPN: RC0603FR-07470K; Category: RESISTOR
R38-R40 R42 R44 R47 R50 = RC0603FR-0751RL: RES SMD 5.1K OHM 1% 1/10W 0603; MPN: RC0603FR-075K1L; MFR: Yageo; Solder: SMT; Value: 5.1K; Category: RESISTOR
R41 = RC0603FR-0710KL: RES SMD 6.19K OHM 1% 1/10W 0603; CompanyID: VT-00328; Solder: SMT; MPN: RC0603FR-0710KL; Value: 6.19K; Category: RESISTOR
R45 R46 R51-R54 R61 R64 R66 R68 R70 R72 = RC0603FR-071KL: as R2 on sheet 4G; MPN: RC0603FR-071KL; Value: 1K; Category: RESISTOR
R57-R59 R62 R65 R69 R73 = RC0603FR-07100KL: as R1 on sheet 4G; MPN: RC0603FR-07100KL; Value: 100K; Category: RESISTOR
TP10-TP25 = Test Point: Solder: NF
U7 = TXS0104EPWR: IC 4BIT NON-INV TRANSLTR 14TSSOP; Solder: SMT; Value: TXS0104EPWR; MPN: TXS0104EPWR; Category: IC
U8 = esp32 wrover b: RX TXRX MODULE WIFI I-PEX SMD; MFR: Espressif; Solder: SMT; Category: MODULE; MPN: ESP32-WROVER-I (8MB); PinCount: 49; Value: ESP32-WROVER-I (8MB)
U9 U13 = PC817: OPTOISOLATOR 5KV TRANS 4SMD; MFR: SHARP/Socle Technology; MPN: PC81710NIP1B; Solder: SMT; PinCount: 4; Category: IC; Value: PC817
U10 = IP101GRI: 10/100Mbps IEEE 802.3/802.3u compliant / Fast Ethernet transceiver; Solder: SMT; Value: IP101GRI; MPN: IP101GRI; Category: IC
U11 = STWD100YNYWY3F: IC SUPERVISOR 1 CHANNEL SOT23-5 (Time of 1.6s); MFR: ST; MPN: STWD100YNYWY3F; Categories: IC
U12 = GD32E230C8T6: IC MCU 32BIT 64KB FLASH 48LQFP; MFR: GigaDevice; Solder: SMT; Value: GD32E230C8T6; MPN: GD32E230C8T6; Category: IC; PinCount: 48
Y1 = ABM8G-25.000MHZ-18-D2Y-T: CRYSTAL 25.0000MHZ 18PF SMD; MFR: Abracon LLC; Solder: SMT; CompanyID: VT-xxx; MPN: ABM8G-25.000MHZ-18-D2Y-T; Value: 25MHz; Category: CRYSTAL

## Sheet Audio.SchDoc: Audio
size A4; DrawnBy: TueTD; Stage: DRAFT
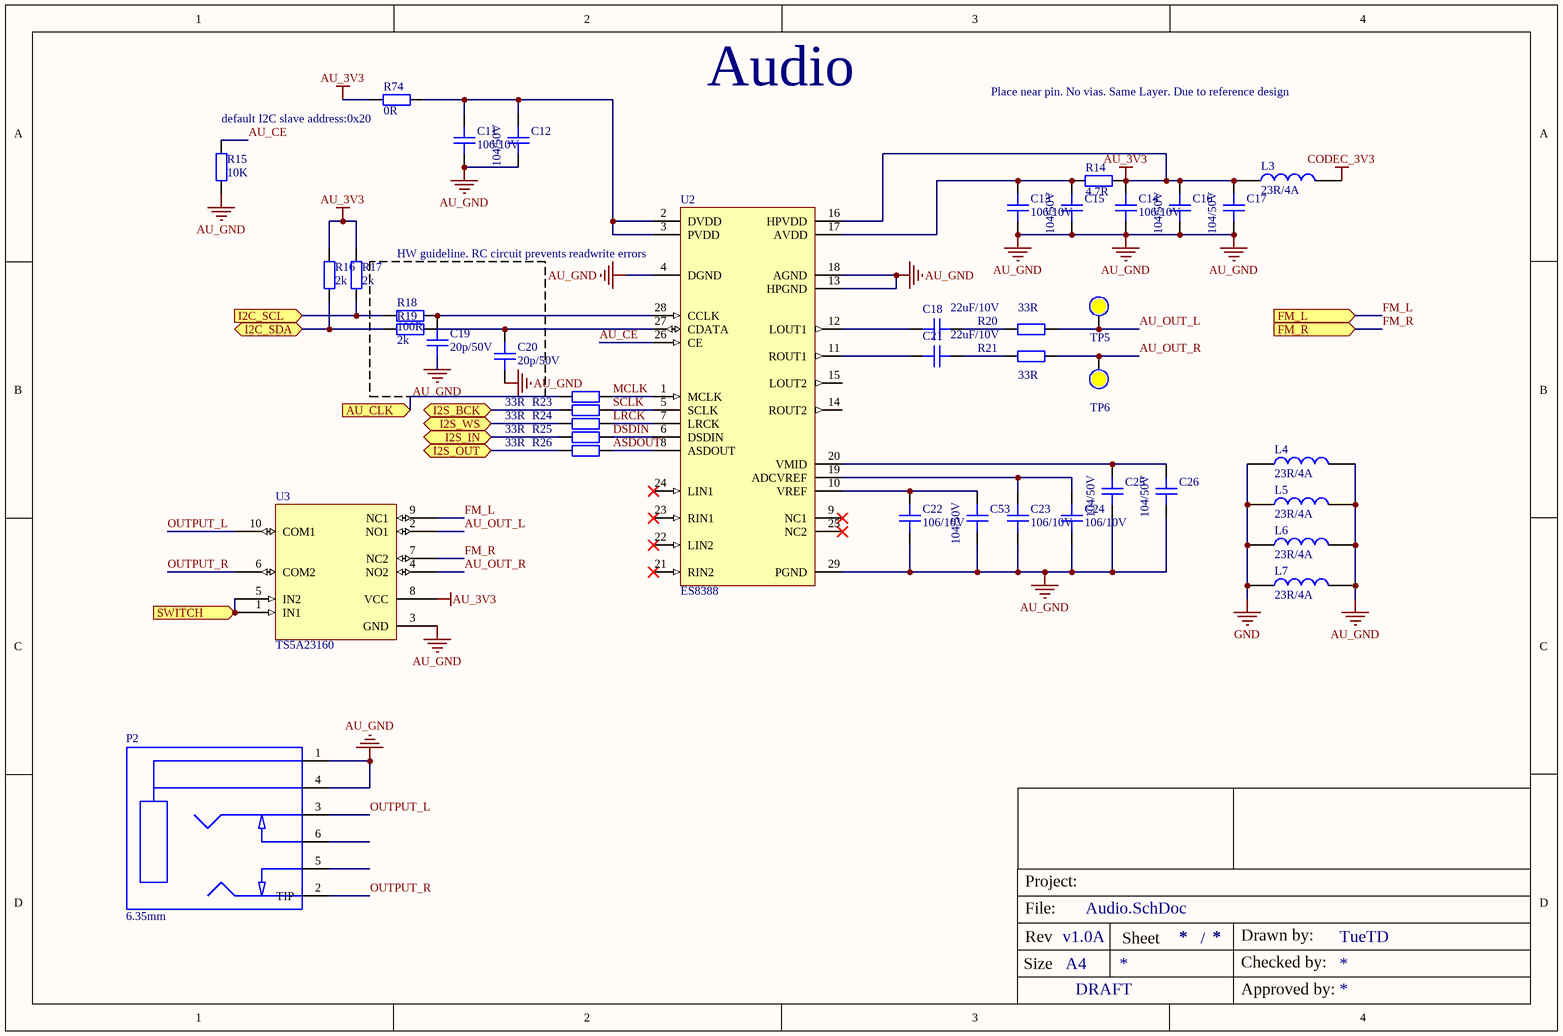
[diagram p6: Audio.SchDoc]

### Parts
C11  106/10V  [CAPC-0603 (1608)]
C12  104/50V  [CAPC-0603 (1608)]
C13  106/10V  [CAPC-0603 (1608)]
C14  106/10V  [CAPC-0603 (1608)]
C15  104/50V  [CAPC-0603 (1608)]
C16  104/50V  [CAPC-0603 (1608)]
C17  104/50V  [CAPC-0603 (1608)]
C18  22uF/10V  [CAPC-0603 (1608)]
C19  20p/50V  [CAPC-0603 (1608)]
C20  20p/50V  [CAPC-0603 (1608)]
C21  22uF/10V  [CAPC-0603 (1608)]
C22  106/10V  [CAPC-0603 (1608)]
C23  106/10V  [CAPC-0603 (1608)]
C24  106/10V  [CAPC-0603 (1608)]
C25  104/50V  [CAPC-0603 (1608)]
C26  104/50V  [CAPC-0603 (1608)]
C53  104/50V  [CAPC-0603 (1608)]
L3  23R/4A  [IND-0603 (1608)]
L4  23R/4A  [IND-0603 (1608)]
L5  23R/4A  [IND-0603 (1608)]
L6  23R/4A  [IND-0603 (1608)]
L7  23R/4A  [IND-0603 (1608)]
P2  6.35mm  [CK-6.35-636A]
R14  4.7R  [RESC-0603 (1608)]
R15  10K  [RESC-0603 (1608)]
R16  2k  [RESC-0603 (1608)]
R17  2k  [RESC-0603 (1608)]
R18  100R  [RESC-0603 (1608)]
R19  2k  [RESC-0603 (1608)]
R20  33R  [RESC-0603 (1608)]
R21  33R  [RESC-0603 (1608)]
R22  33R  [RESC-0603 (1608)]  (value not drawn)
R23  33R  [RESC-0603 (1608)]
R24  33R  [RESC-0603 (1608)]
R25  33R  [RESC-0603 (1608)]
R26  33R  [RESC-0603 (1608)]
R74  0R  [RESC-0603 (1608)]
TP5  (no value)  [Test Point 1.5 MM]  (no BOM)
TP6  (no value)  [Test Point 1.5 MM]  (no BOM)
U2  ES8388  [QFN28 - ES8388]
U3  TS5A23160  [TSSOP50P490X110-10N]

### Blocks framed on the sheet
HW guideline. RC circuit prevents readwrite errors: C19 C20 R18 R19

### Ports
AU_CLK (in), FM_L (in), FM_R (in), I2C_SCL (in), I2C_SDA (bidir), I2S_BCK (bidir), I2S_IN (bidir), I2S_OUT (bidir), I2S_WS (bidir), SWITCH (in)

### Nets
AU_3V3: C14.2 C16.2 C17.2 L3.1 R14.2 R16.2 R17.2 R74.1 U2.16(HPVDD) U3.8(VCC)
AU_GND: C11.1 C12.1 C13.1 C14.1 C15.1 C16.1 C17.1 C19.1 C20.1 C22.1 C23.1 C24.1 C25.1 C26.1 C53.1 L4.2 L5.2 L6.2 L7.2 P2.1(SLEEVE) P2.4(SLEEVE) R15.1 U2.4(DGND) U2.13(HPGND) U2.18(AGND) U2.29(PGND) U3.3(GND)
CODEC_3V3: L3.2
GND: L4.1 L5.1 L6.1 L7.1
ASDOUT: R26.2 U2.8(ASDOUT)
AU_CE: R15.2 U2.26(CE)
AU_OUT_L: R20.2 TP5.0 U3.2(NO1)
AU_OUT_R: R21.2 TP6.0 U3.4(NO2)
DSDIN: R25.2 U2.6(DSDIN)
ESP_RX: R22.1 ; port AU_CLK
FM_L: U3.9(NC1) ; port FM_L
FM_R: U3.7(NC2) ; port FM_R
LRCK: R24.2 U2.7(LRCK)
MCLK: R22.2 U2.1(MCLK)
OUTPUT_L: P2.3(RING) U3.10(COM1)
OUTPUT_R: P2.2(TIP) U3.6(COM2)
SCL: R17.1 R18.1 ; port I2C_SCL
SCLK: R23.2 U2.5(SCLK)
SDA: R16.1 R19.1 ; port I2C_SDA
SWITCH_FM: U3.1(IN1) U3.5(IN2) ; port SWITCH
NetC11_2: C11.2 C12.2 R74.2 U2.2(DVDD) U2.3(PVDD)
NetC13_2: C13.2 C15.2 R14.1 U2.17(AVDD)
NetC18_1: C18.1 R20.1
NetC18_2: C18.2 U2.12(LOUT1)
NetC19_2: C19.2 R18.2 U2.28(CCLK)
NetC20_2: C20.2 R19.2 U2.27(CDATA)
NetC21_1: C21.1 R21.1
NetC21_2: C21.2 U2.11(ROUT1)
NetC22_2: C22.2 C53.2 U2.10(VREF)
NetC23_2: C23.2 C24.2 U2.19(ADCVREF)
NetC25_2: C25.2 C26.2 U2.20(VMID)
NetR23_1: R23.1 ; port I2S_BCK
NetR24_1: R24.1 ; port I2S_WS
NetR25_1: R25.1 ; port I2S_IN
NetR26_1: R26.1 ; port I2S_OUT

Not connected (* = marked no-connect by the designer): P2 5(TIP_SWITCH) 6(RING_SWITCH); U2 9(NC1)* 14(ROUT2) 15(LOUT2) 21(RIN2)* 22(LIN2)* 23(RIN1)* 24(LIN1)* 25(NC2)*

### Notes on the sheet
- Place near pin. No vias. Same Layer. Due to reference design
- (near R74) default I2C slave address:0x20
- Project:
- File:
- Size
- Rev
- A4
- Sheet
- /
- Drawn by:
- Checked by:
- Approved by:

### Library data of the parts
C11 C13 C14 C22-C24 = CL10A106KP8NNNC: as C49 on sheet Wifi; MPN: CL10A106KP8NNNC; Value: 106/10V; Category: CAPACITOR
C12 C15-C17 C25 C26 C53 = C0603C104K5RACTU: as C3 on sheet 4G; MPN: C0603C104K5RACTU; Value: 104/50V; Category: CAPACITOR
C18 C21 = CL10A226MPCNUBE: CAP CER 22UF 10V X5R 0603; CompanyID: VT-00192; Solder: SMT; MPN: CL10A226MPCNUBE; Value: 22uF/10V; Category: CAPACITOR
C19 C20 = CL10C200JB8NNNC: CAP CER 20pF 5% 50V C0G/NP0 0603; CompanyID: VT-00515; Solder: SMT; Value: 20p/50V; MPN: CL10C200JB8NNNC; Category: CAPACITOR
L3-L7 = FBMJ1608HM230NT: as L1 on sheet 4G; MPN: FBMJ1608HM230NT; Value: 23R/4A; Category: FERRITE BEAD
P2 = CK-6.35-636A: CONN JACK STEREO 1/4" R/A; MFR: DONGGUAN YIJIAN ELECTRONICS CO., LTD.; Solder: WAVE; MFR_URL: https://wzyjdzkj.taobao.com; MPN: CK-6.35-636A; Value: CK-6.35-636A; ClassName: MECHANICAL
R14 = RC0603FR-074R7L: RES SMD 4.7 OHM 1% 1/10W 0603; Solder: SMT; Value: 4.7R; MPN: RC0603FR-074R7L; Category: RESISTOR
R15 = RC0603FR-0710KL: as R5 on sheet 4G; MPN: RC0603FR-0710KL; Value: 10K; Category: RESISTOR
R16 R17 R19 = RC0603FR-072KL: RES SMD 2 KOHM 1% 1/10W 0603; CompanyID: VT-00326; Solder: SMT; MPN: RC0603FR-072KL; Value: 2k; Category: RESISTOR
R18 = RC0603FR-07100RL: RES SMD 100 OHM 1% 1/10W 0603; CompanyID: VT-00499; Solder: SMT; MPN: RC0603FR-07100RL; Value: 100R; Category: RESISTOR
R20-R26 = RC0603FR-0733RL: as R10 on sheet 4G; MPN: RC0603FR-0733RL; Value: 33R; Category: RESISTOR
R74 = RC0603FR-070RL: as R9 on sheet 4G; MPN: RC0603FR-070RL; Value: 0R; Category: RESISTOR
TP5 TP6 = Test Point: Solder: NF
U2 = ES8388: The Audio Codec Chip, is a low power stereo audio codec; MFR: Everest-Semi; Solder: SMT; MPN: ES8388; Value: ES8388; Category: IC; PinCount: 29
U3 = TS5A23160DGSR: IC SWITCH SPDT DUAL 10VSSOP; MFR: Texas Instruments; Solder: SMT; MPN: TS5A23160DGSR; Value: TS5A23160; Category: IC

## Sheet Power.SchDoc: POWER
size A4; Organization: Altium Limited; Address1: L3, 12a Rodborough Rd; Address2: Frenchs Forest; Address3: NSW; Address4: Australia 2086; Stage: DRAFT
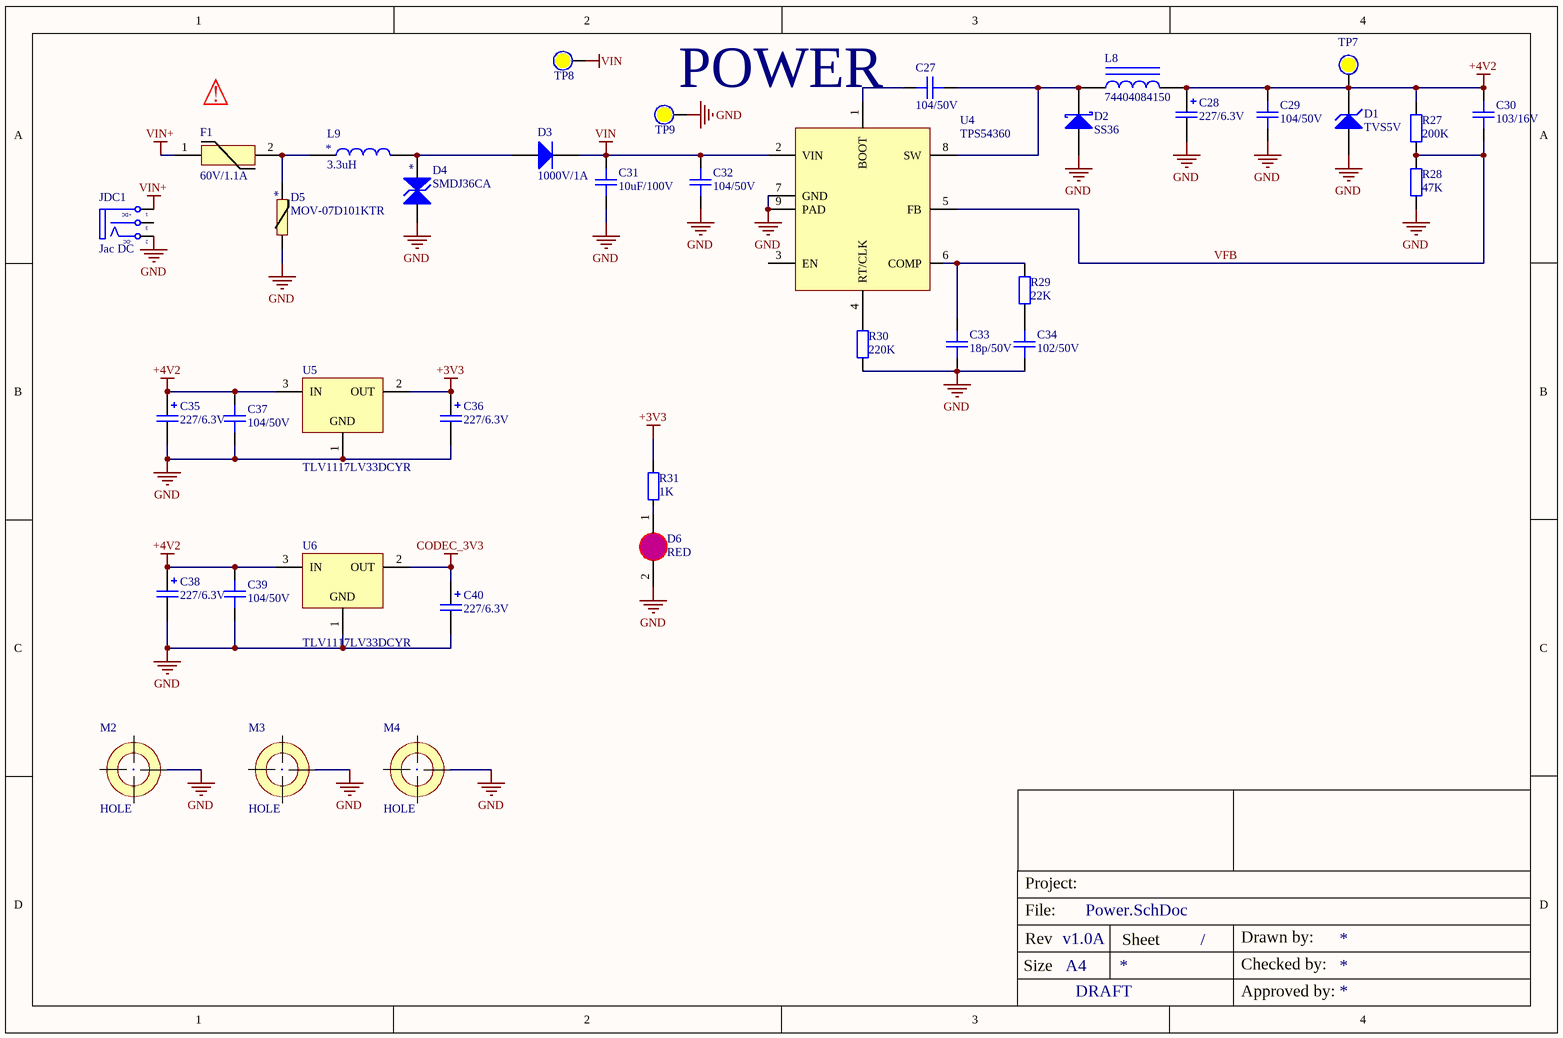
[diagram p7: Power.SchDoc]

### Parts
C27  104/50V  [CAPC-0603 (1608)]
C28  227/6.3V  [CAP_TANTAL_1210(3528)]
C29  104/50V  [CAPC-0603 (1608)]
C30  103/16V  [CAPC-0603 (1608)]
C31  10uF/100V  [CAPC-2220 (5750)]
C32  104/50V  [CAPC-0603 (1608)]
C33  18p/50V  [CAPC-0603 (1608)]
C34  102/50V  [CAPC-0603 (1608)]
C35  227/6.3V  [CAP_TANTAL_1210(3528)]
C36  227/6.3V  [CAP_TANTAL_1210(3528)]
C37  104/50V  [CAPC-0603 (1608)]
C38  227/6.3V  [CAP_TANTAL_1210(3528)]
C39  104/50V  [CAPC-0603 (1608)]
C40  227/6.3V  [CAP_TANTAL_1210(3528)]
D1  TVS5V  [DIODE_DO214AC_SMA]
D2  SS36  [DIODE_DO214AC_SMA]
D3  1000V/1A  [DIODE_DO214AC_SMA]
D4  SMDJ36CA  [DIODE_DO214AB_SMC]
D5  MOV-07D101KTR  [MOV-07D101KTR]
D6  RED  [LED_0805_RED]
F1  60V/1.1A  [RKEF110]
JDC1  Jac DC  [DC0]
L8  74404084150  [IND-74404084150]
L9  3.3uH  [IND-CD74-7x7x4MM]
M2  HOLE  [HOLE_3MM_6MM]  (no BOM)
M3  HOLE  [HOLE_3MM_6MM]  (no BOM)
M4  HOLE  [HOLE_3MM_6MM]  (no BOM)
R27  200K  [RESC-0603 (1608)]
R28  47K  [RESC-0603 (1608)]
R29  22K  [RESC-0603 (1608)]
R30  220K  [RESC-0603 (1608)]
R31  1K  [RESC-0603 (1608)]
TP7  (no value)  [Test Point 1.5 MM]  (no BOM)
TP8  (no value)  [Test Point 1.5 MM]  (no BOM)
TP9  (no value)  [Test Point 1.5 MM]  (no BOM)
U4  TPS54360  [SOIC8 - POWER]
U5  TLV1117LV33DCYR  [SOT-223-4]
U6  TLV1117LV33DCYR  [SOT-223-4]

### Nets
+3V3: C36.1 R31.2 U5.2(OUT)
+4V2: C28.1 C29.2 C30.2 C35.1 C37.1 C38.1 C39.1 D1.2(K) L8.2 R27.2 TP7.0 U5.3(IN) U6.3(IN)
CODEC_3V3: C40.1 U6.2(OUT)
GND: C28.2 C29.1 C31.1 C32.1 C33.1 C34.1 C35.2 C36.2 C37.2 C38.2 C39.2 C40.2 D1.1(A) D2.1(A) D4.1(A) D5.1(A) D6.2(K) JDC1.2(TN) R28.1 R30.1 TP9.0 U4.7(GND) U4.9(PAD) U5.1(GND) U6.1(GND)
VIN: C31.2 C32.2 D3.2(K) TP8.0 U4.2(VIN)
VIN+: F1.1 JDC1.1(T)
VFB: C30.1 R27.1 R28.2 U4.5(FB)
NetC27_1: C27.1 D2.2(K) L8.1 U4.8(SW)
NetC27_2: C27.2 U4.1(BOOT)
NetC33_2: C33.2 R29.2 U4.6(COMP)
NetC34_2: C34.2 R29.1
NetD3_1: D3.1(A) D4.2(K) L9.2
NetD5_2: D5.2(K) F1.2 L9.1
NetD6_1: D6.1(A) R31.1
NetR30_2: R30.2 U4.4(RT/CLK)

Not connected (* = marked no-connect by the designer): JDC1 3(S); U4 3(EN)

### Notes on the sheet
- (near F1) ⚠
- Project:
- File:
- Size
- Rev
- A4
- Sheet
- /
- Drawn by:
- Checked by:
- Approved by:
- (in symbol DCIN) +DC; -DC

### Library data of the parts
C27 C29 C32 C37 C39 = C0603C104K5RACTU: as C3 on sheet 4G; MPN: C0603C104K5RACTU; Value: 104/50V; Category: CAPACITOR
C28 C35 C36 C38 C40 = T520B227M006ATE035: as C4 on sheet 4G; Value: 227/6.3V; MPN: T520B227M006ATE035; Category: CAPACITOR
C30 = CC0603KRX7R7BB103: CAP CER 10nF 16V 10% X7R 0603; CompanyID: VT-00592; Solder: SMT; MPN: CC0603KRX7R7BB103; Value: 103/16V; Category: CAPACITOR
C31 = 22201C106MAT2A: CAP CER 10UF 100V X7R 2220; MFR: AVX Corporation; Solder: SMT; MPN: 22201C106MAT2A; Value: 10uF/100V; Category: CAPACITOR; PinCount: 2
C33 = CL10C180JB8NNNC: CAP CER 18pF 5% 50V C0G/NP0 0603; CompanyID: VT-00985; Solder: SMT; Value: 18p/50V; MPN: CL10C180JB8NNNC; Category: CAPACITOR
C34 = C0603C102K5RACTU: CAP CER 1nF 50V 10% X7R 0603; CompanyID: VT-00573; Solder: SMT; MPN: C0603C102K5RACTU; Value: 102/50V; Category: CAPACITOR
D1 = SMAJ5.0A-E3/61: DIODE TVS 5VWM 9.2VC SMA; Value: 9.2V/43.5A; Solder: SMT; CompanyID: VT-00317; MPN: SMAJ5.0A-E3/61
D2 = B340A-E3/61T: DIODE SCHOTTKY 60V 3A DO214AC; Value: 60V/3A; Solder: SMT; MPN: SS36
D3 = 1N4007_SMA: DIODE GEN PURP 1KV 1A SMA; MPN: MRA4007T3G; Solder: SMT; Value: 1000V/1A; MFR: *
D4 = SMDJ36CA: DIODE TVS 36VWM 58.1VC 3KW SMD; CompanyID: VT00550; Solder: SMT; Value: SMDJ36CA; MPN: SMDJ36CA
D5 = MOV-07D101KTR: VARISTOR 100V 1.2KA DISC 7MM; Solder: SMT; Value: MOV-07D101KTR; MPN: MOV-07D101KTR
D6 = 17-215SURC/S530-A3/TR8: LED RED CLEAR 0805 SMD; Solder: SMT; CompanyID: VT-00379; Value: RED; MPN: 17-215SURC/S530-A3/TR8
F1 = RKEF110: PTC RESET FUSE 60V 1.1A RADIAL; MFR: Littelfuse Inc.; Solder: WAVE; MPN: RKEF110; Value: 60V/1.1A
JDC1 = DCIN: Jac DC input; Value: Jac DC
L8 = SRR1260-150MCT-ND: FIXED IND 15UH 2.6A 47 MOHM SMD; MFR: Würth Elektronik; MPN: 74404084150; Category: INDUCTOR
L9 = CD74_3U3: IND-FIXED 3.3uH CD74 7.4 x 7.4 x 4 MM; Solder: SMT; MPN: CD74_3U3; Value: 3.3uH; Category: INDUCTOR; PinCount: 2
M2-M4 = HOLE_3_5: 3mm/5mm; MPN: None; Solder: Not Fill; CompanyID: VT-; ClassName: MECH_HOLE; Value: HOLE
R27 = RC0603FR-07220KL: RES SMD 200K OHM 1% 1/10W 0603; MPN: RC0603FR-07200KL; CompanyID: VT-00761; Solder: SMT; Value: 200K; Category: RESISTOR
R28 = RC0603FR0747KL: RES SMD 47K OHM 1% 1/10W 0603; CompanyID: VT-00322; Solder: SMT; Value: 47K; MPN: RC0603FR0747KL; Category: RESISTOR
R29 = RC0603FR-0722KL: RES SMD 22K OHM 1% 1/10W 0603; Solder: SMT; CompanyID: VT-00320; Value: 22K; MPN: RC0603FR-0722KL; Category: RESISTOR
R30 = RC0603FR-07220KL: RES SMD 220K OHM 1% 1/10W 0603; Solder: SMT; MPN: RC0603FR-07220KL; Value: 220K; Category: RESISTOR
R31 = RC0603FR-071KL: as R2 on sheet 4G; MPN: RC0603FR-071KL; Value: 1K; Category: RESISTOR
TP7-TP9 = Test Point: Solder: NF
U4 = TPS54360: 60 V Input, 3.5 A, step down regulator with an integrated high side MOSFET; Brand: TI; 1: xx; Part Number: TPS54360
U5 U6 = TLV1117LV33: Single Output LDO, 1 A, Fixed 3.3 V Output, 2 to 5.5 V Input, 4-pin SOT-223 (DCY), -40 to 125 degC, Green (RoHS & no Sb/Br); MFR: Texas Instruments; Solder: SMT; CompanyID: VT00286; MPN: TLV1117LV33DCYR; Value: TLV1117LV33; Category: IC

## Nets that join several sheets
+3V3: Wifi (42 pins), Power (C36.1 R31.2 U5.2)
+4V2: 4G (R1.1 T1.2), Wifi (L11.1), Power (13 pins)
CODEC_3V3: Audio (L3.2), Power (C40.1 U6.2)
GND: 4G (63 pins), Wifi (51 pins), Audio (L4.1 L5.1 L6.1 L7.1), Power (25 pins)
VDD_1V8: 4G (M1.7 TP4.0), Wifi (R58.1 R59.1 U7.1 U7.8)
ESP_RX: Wifi (P5.5 TP16.0 U8.34), Audio (R22.1)
FM_L: Wifi (P4.5), Audio (U3.9)
FM_R: Wifi (P4.6), Audio (U3.7)
GSM_PWKEY: 4G (R2.1), Wifi (U12.17)
GSM_PWR_EN: 4G (R7.1), Wifi (U12.20)
GSM_RESET: 4G (R3.1), Wifi (U12.16)
NetM1_62: 4G (M1.62), Wifi (R58.2 U7.4)
NetM1_67: 4G (M1.67), Wifi (R59.2 U7.3)
NetM1_68: 4G (M1.68), Wifi (U7.2)
NetR23_1: Wifi (U8.26), Audio (R23.1)
NetR24_1: Wifi (U8.8), Audio (R24.1)
NetR25_1: Wifi (U8.9), Audio (R25.1)
NetR26_1: Wifi (U8.7), Audio (R26.1)
SCL: Wifi (U8.30), Audio (R17.1 R18.1)
SDA: Wifi (U8.29), Audio (R16.1 R19.1)
SWITCH_FM: Wifi (U12.11), Audio (U3.1 U3.5)